# EAGLE schematic LED_matrix (EAGLE 7.7.0)
DRAWING_NUMBER: S001; DRAWN: Mario Blunk / Blunk electronic; PROJECT: LED-Matrix; STATUS: EDUCATION

## Sheet 1 of 11
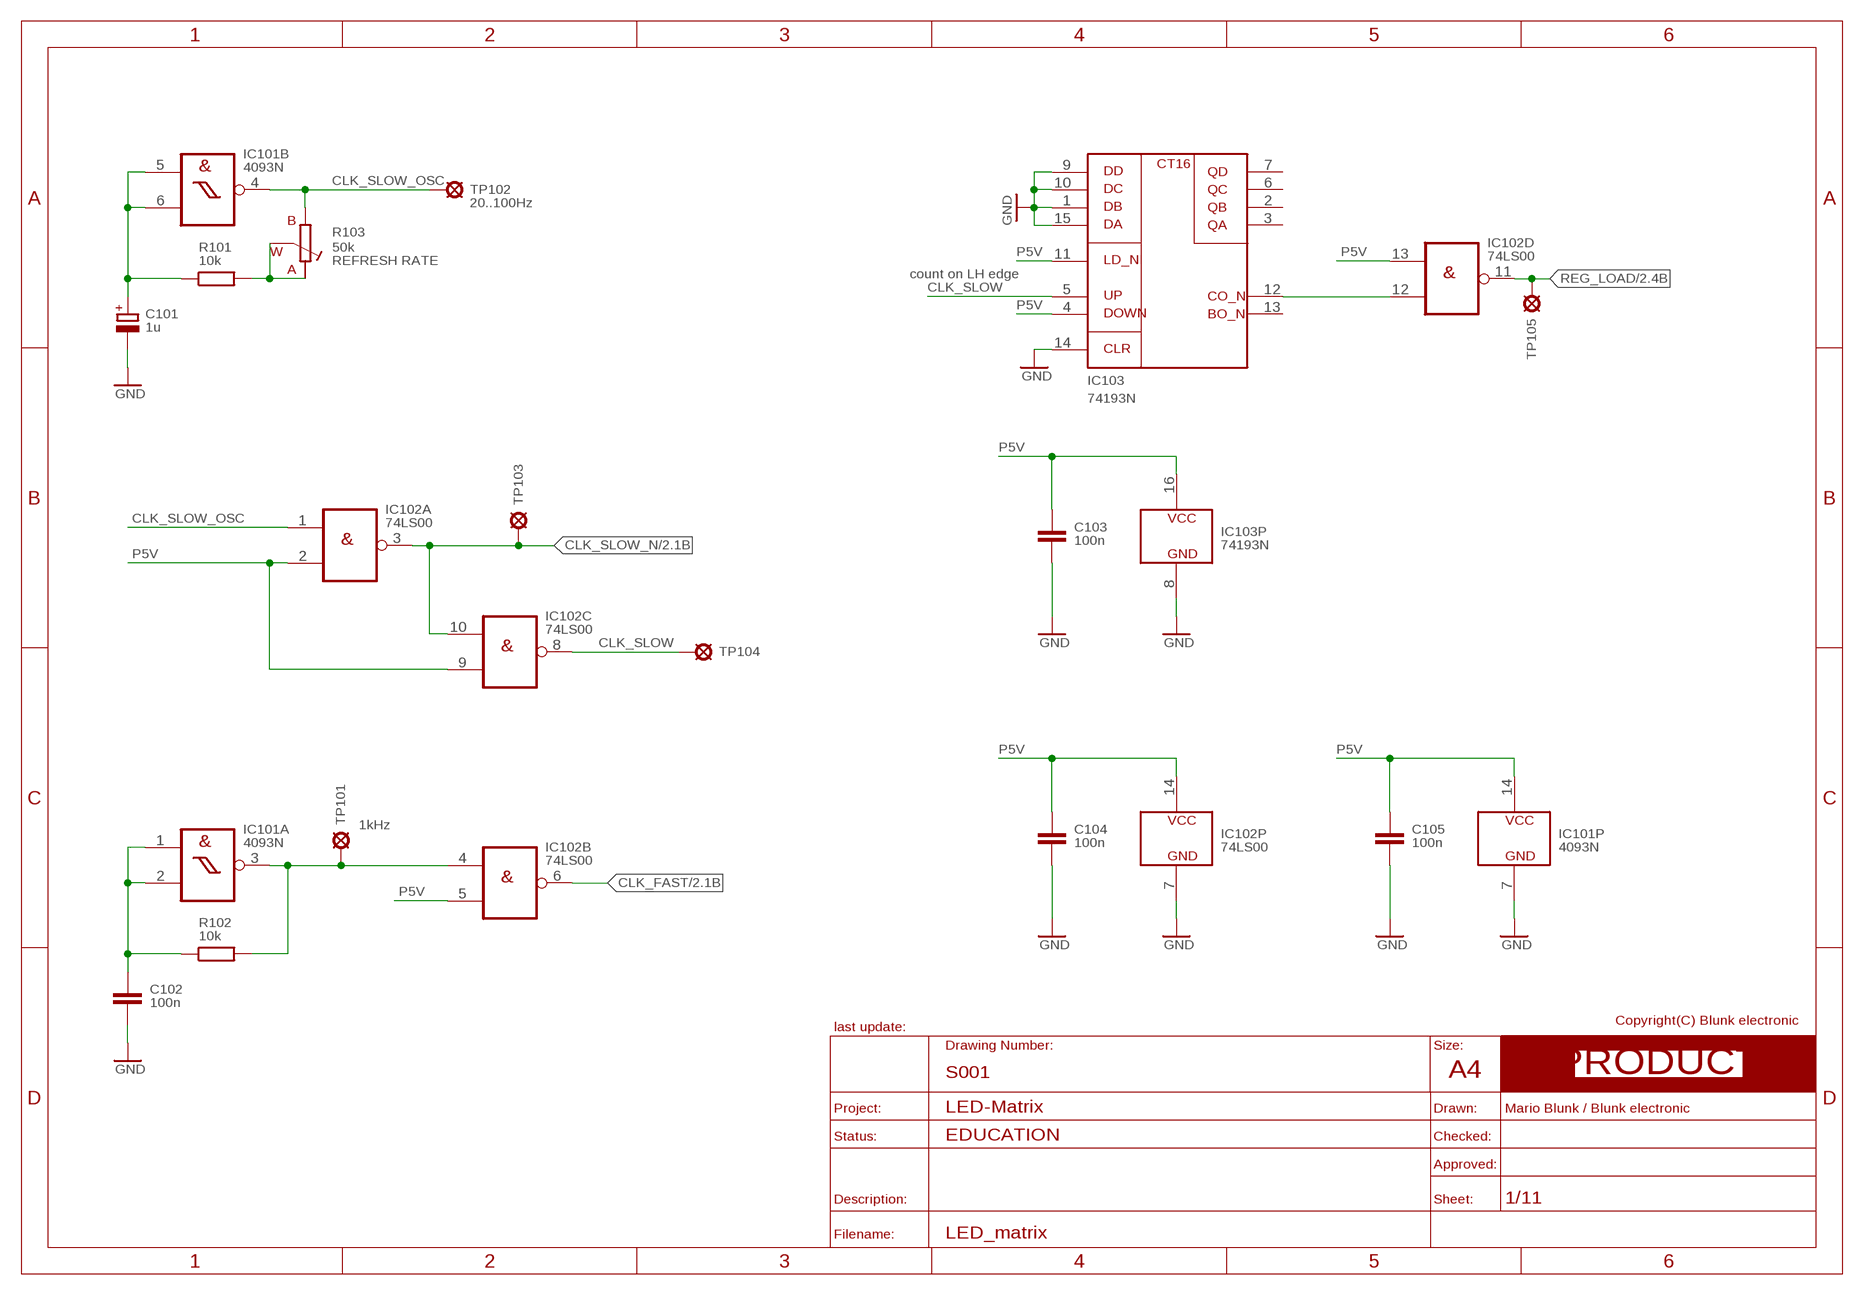
[diagram p0: schematic, sheet 1]
FRAME_PRODUCT1 (A4_LANDSCAPE_PRODUCT): BOM: NO; COMMISSIONED: 2013-08-30

### Parts
C101  1u  C_POL_T_RAD5_GRID_2.54  [T_RADIAL_5MM_GRID_2.54MM]
C102  100n  C_T_DISC_4MM_PITCH_5MM  [T_DISC_4MM_PITCH_5MM]
C103  100n  C_T_DISC_4MM_PITCH_5MM  [T_DISC_4MM_PITCH_5MM]
C104  100n  C_T_DISC_4MM_PITCH_5MM  [T_DISC_4MM_PITCH_5MM]
C105  100n  C_T_DISC_4MM_PITCH_5MM  [T_DISC_4MM_PITCH_5MM]
IC101  4093N  [T_NDIP14]
IC102  74LS00  7400N  [T_NDIP14]
IC103  74193N  [T_NDIP16]
R101  10k  R_T_0207_PITCH_10MM  [T_0207_PITCH_10MM]
R102  10k  R_T_0207_PITCH_10MM  [T_0207_PITCH_10MM]
R103  50k  RA_T_PT10_HORIZONTAL  [T_TRIM_PIHER_PT10_HORIZONTAL]
TP101  TEST_POINT_T_SMALL  [T_TEST_POINT_SMALL]
TP102  TEST_POINT_T_SMALL  [T_TEST_POINT_SMALL]
TP103  TEST_POINT_T_SMALL  [T_TEST_POINT_SMALL]
TP104  TEST_POINT_T_SMALL  [T_TEST_POINT_SMALL]
TP105  TEST_POINT_T_SMALL  [T_TEST_POINT_SMALL]

### Nets
CLK_FAST: IC102.6(B:O) ; also sheet 2
CLK_FAST_OSC: IC101.3(A:O) IC102.4(B:I0) R102.2 TP101.1(TP)
CLK_FAST_RC: C102.1 IC101.1(A:I0) IC101.2(A:I1) R102.1
CLK_SLOW: IC102.8(C:O) IC103.5(UP) TP104.1(TP)
CLK_SLOW_N: IC102.3(A:O) IC102.10(C:I0) TP103.1(TP) ; also sheet 2,3,4,5
CLK_SLOW_OSC: IC101.4(B:O) IC102.1(A:I0) R103.B TP102.1(TP)
CLK_SLOW_RA: R101.2 R103.A R103.W
CLK_SLOW_RC: C101.+ IC101.5(B:I0) IC101.6(B:I1) R101.1
CT_CO_N: IC102.12(D:I1) IC103.12(CO_N)
GND: C101.- C102.2 C103.2 C104.2 C105.2 IC101.7(P:GND) IC102.7(P:GND) IC103.1(DB) IC103.8(GND) IC103.9(DD) IC103.10(DC) IC103.14(CLR) IC103.15(DA) ; also sheet 2,3,4,5,7,8,9,10,11
P5V: C103.1 C104.1 C105.1 IC101.14(P:VCC) IC102.2(A:I1) IC102.5(B:I1) IC102.9(C:I1) IC102.13(D:I0) IC102.14(P:VCC) IC103.4(DOWN) IC103.11(LD_N) IC103.16(VCC) ; also sheet 2,3,4,5,6,9,10,11
REG_LOAD: IC102.11(D:O) TP105.1(TP) ; also sheet 2,3,4,5
Unconnected: IC103.2(QB) IC103.3(QA) IC103.6(QC) IC103.7(QD) IC103.13(BO_N)

### Notes on the sheet
- 20..100Hz
- count on LH edge
- 1kHz

## Sheet 2 of 11
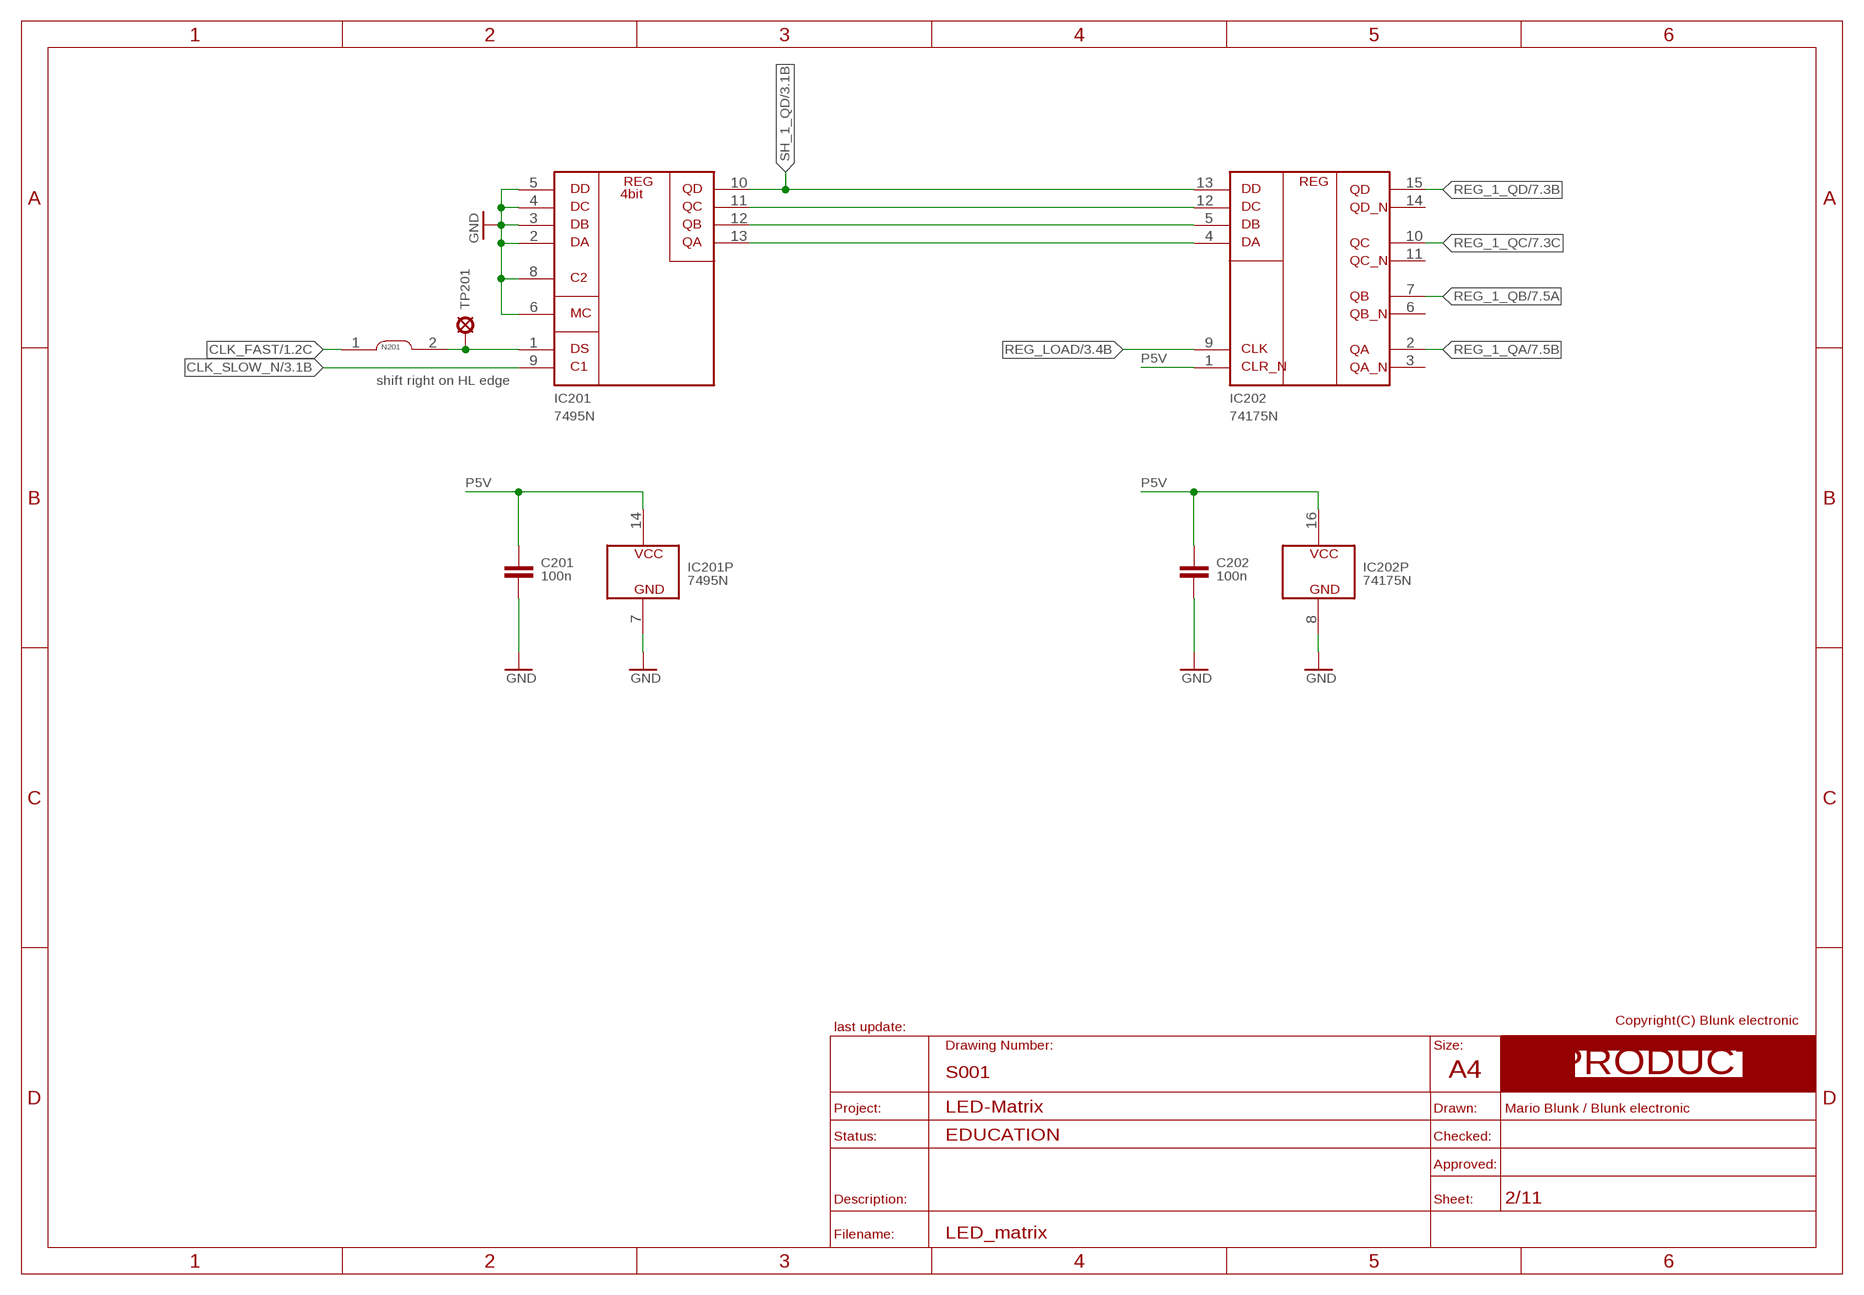
[diagram p1: schematic, sheet 2]
FRAME_PRODUCT2 (A4_LANDSCAPE_PRODUCT): BOM: NO; COMMISSIONED: 2013-08-30

### Parts
C201  100n  C_T_DISC_4MM_PITCH_5MM  [T_DISC_4MM_PITCH_5MM]
C202  100n  C_T_DISC_4MM_PITCH_5MM  [T_DISC_4MM_PITCH_5MM]
IC201  7495N  [T_NDIP14]
IC202  74175N  [T_NDIP16]
N201  NET_CHANGER-S-0.3MM  [S_NET_CHANGER_0.3MM]
TP201  TEST_POINT_T_SMALL  [T_TEST_POINT_SMALL]

### Nets
CLK_FAST: N201.1 ; also sheet 1
CLK_SLOW_N: IC201.9(C1) ; also sheet 1,3,4,5
GND: C201.2 C202.2 IC201.2(DA) IC201.3(DB) IC201.4(DC) IC201.5(DD) IC201.6(MC) IC201.7(GND) IC201.8(C2) IC202.8(GND) ; also sheet 1,3,4,5,7,8,9,10,11
P5V: C201.1 C202.1 IC201.14(VCC) IC202.1(CLR_N) IC202.16(VCC) ; also sheet 1,3,4,5,6,9,10,11
REG_1_QA: IC202.2(QA) ; also sheet 7
REG_1_QB: IC202.7(QB) ; also sheet 7
REG_1_QC: IC202.10(QC) ; also sheet 7
REG_1_QD: IC202.15(QD) ; also sheet 7
REG_LOAD: IC202.9(CLK) ; also sheet 1,3,4,5
SH_1_DS: IC201.1(DS) N201.2 TP201.1(TP)
SH_1_QA: IC201.13(QA) IC202.4(DA)
SH_1_QB: IC201.12(QB) IC202.5(DB)
SH_1_QC: IC201.11(QC) IC202.12(DC)
SH_1_QD: IC201.10(QD) IC202.13(DD) ; also sheet 3
Unconnected: IC202.3(QA_N) IC202.6(QB_N) IC202.11(QC_N) IC202.14(QD_N)

### Notes on the sheet
- shift right on HL edge

## Sheet 3 of 11
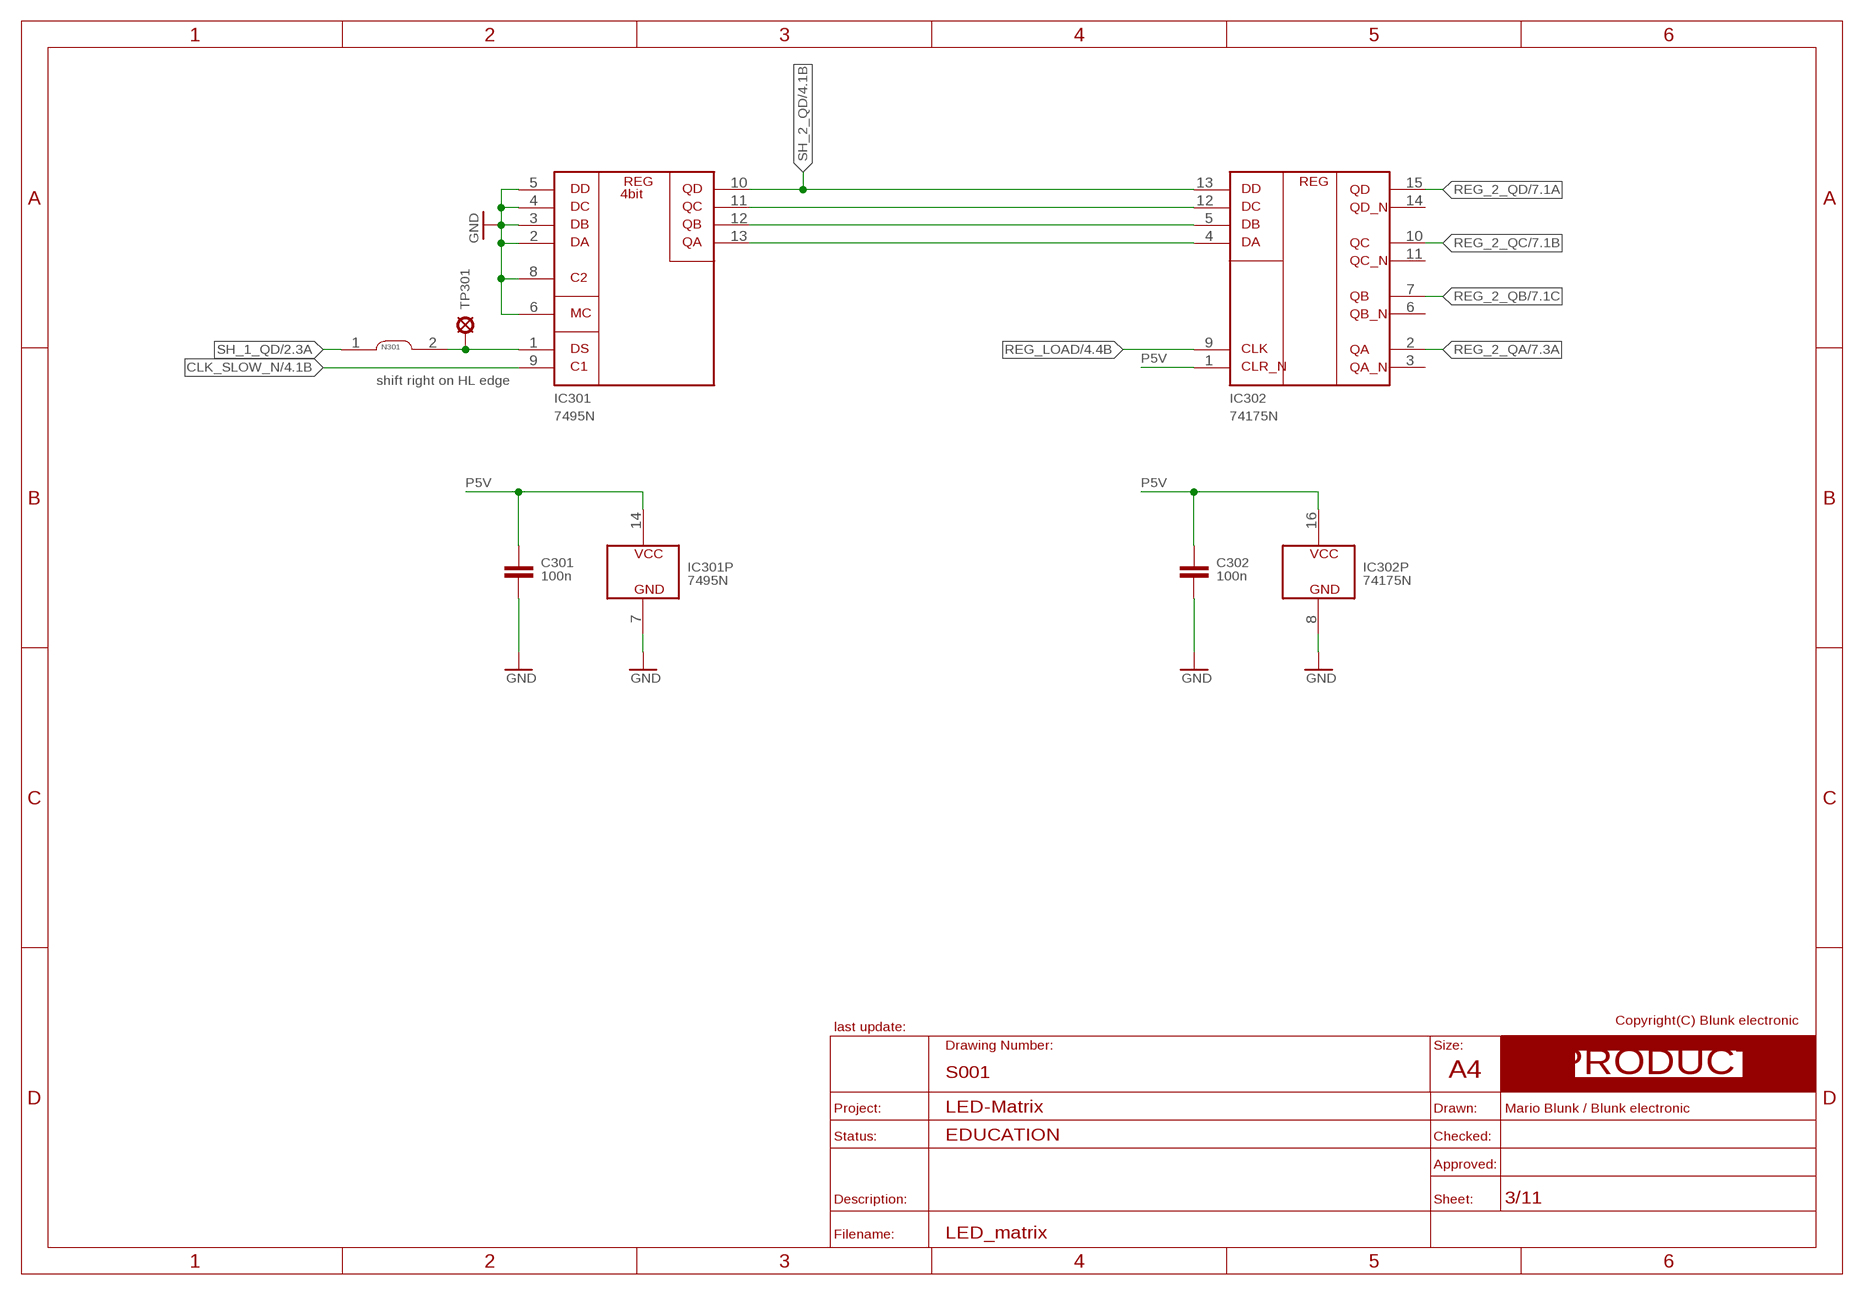
[diagram p2: schematic, sheet 3]
FRAME_PRODUCT6 (A4_LANDSCAPE_PRODUCT): BOM: NO; COMMISSIONED: 2013-08-30

### Parts
C301  100n  C_T_DISC_4MM_PITCH_5MM  [T_DISC_4MM_PITCH_5MM]
C302  100n  C_T_DISC_4MM_PITCH_5MM  [T_DISC_4MM_PITCH_5MM]
IC301  7495N  [T_NDIP14]
IC302  74175N  [T_NDIP16]
N301  NET_CHANGER-S-0.3MM  [S_NET_CHANGER_0.3MM]
TP301  TEST_POINT_T_SMALL  [T_TEST_POINT_SMALL]

### Nets
CLK_SLOW_N: IC301.9(C1) ; also sheet 1,2,4,5
GND: C301.2 C302.2 IC301.2(DA) IC301.3(DB) IC301.4(DC) IC301.5(DD) IC301.6(MC) IC301.7(GND) IC301.8(C2) IC302.8(GND) ; also sheet 1,2,4,5,7,8,9,10,11
P5V: C301.1 C302.1 IC301.14(VCC) IC302.1(CLR_N) IC302.16(VCC) ; also sheet 1,2,4,5,6,9,10,11
REG_2_QA: IC302.2(QA) ; also sheet 7
REG_2_QB: IC302.7(QB) ; also sheet 7
REG_2_QC: IC302.10(QC) ; also sheet 7
REG_2_QD: IC302.15(QD) ; also sheet 7
REG_LOAD: IC302.9(CLK) ; also sheet 1,2,4,5
SH_1_DS1: IC301.1(DS) N301.2 TP301.1(TP)
SH_1_QD: N301.1 ; also sheet 2
SH_2_QA: IC301.13(QA) IC302.4(DA)
SH_2_QB: IC301.12(QB) IC302.5(DB)
SH_2_QC: IC301.11(QC) IC302.12(DC)
SH_2_QD: IC301.10(QD) IC302.13(DD) ; also sheet 4
Unconnected: IC302.3(QA_N) IC302.6(QB_N) IC302.11(QC_N) IC302.14(QD_N)

### Notes on the sheet
- shift right on HL edge

## Sheet 4 of 11
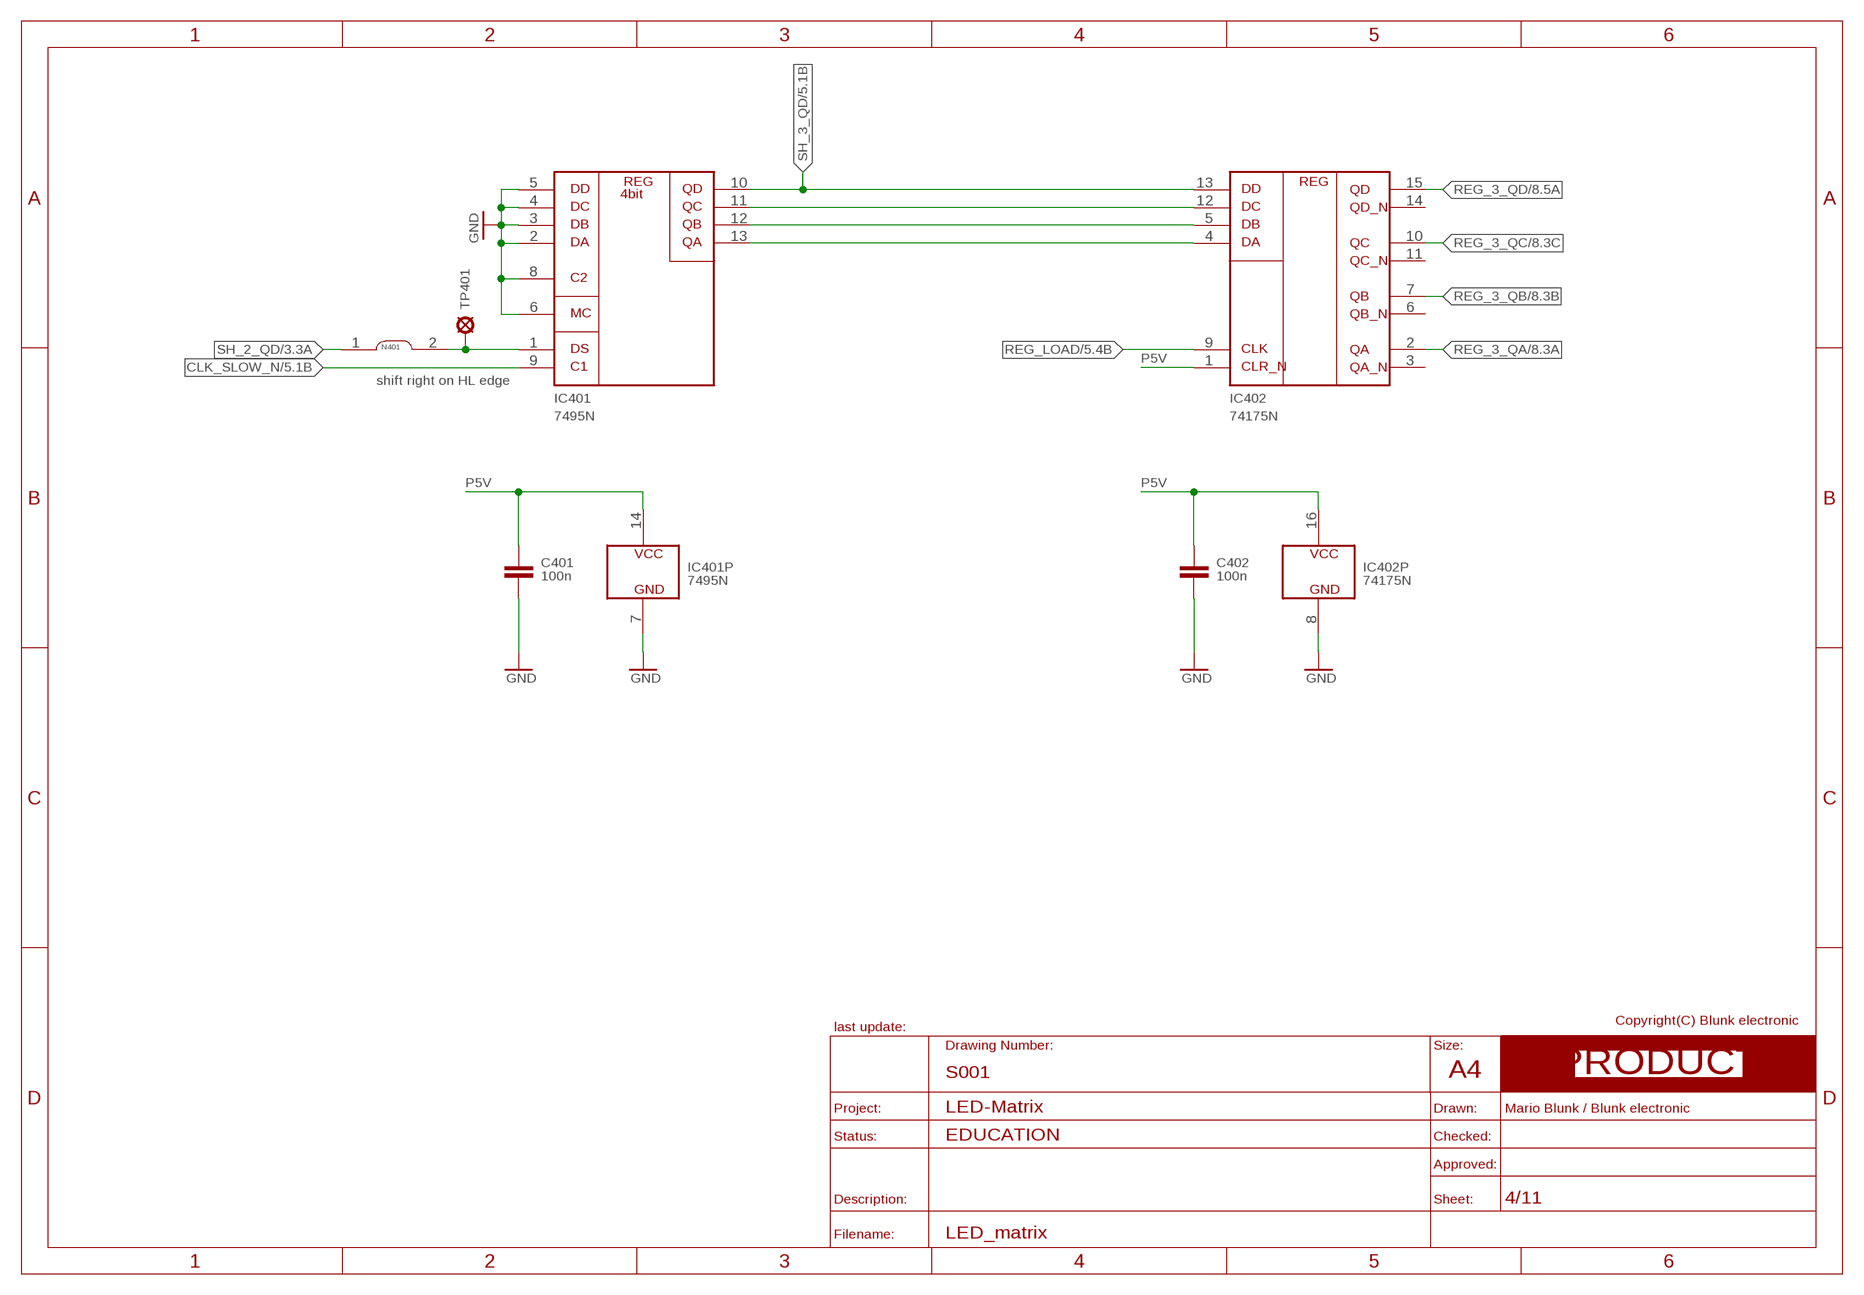
[diagram p3: schematic, sheet 4]
FRAME_PRODUCT7 (A4_LANDSCAPE_PRODUCT): BOM: NO; COMMISSIONED: 2013-08-30

### Parts
C401  100n  C_T_DISC_4MM_PITCH_5MM  [T_DISC_4MM_PITCH_5MM]
C402  100n  C_T_DISC_4MM_PITCH_5MM  [T_DISC_4MM_PITCH_5MM]
IC401  7495N  [T_NDIP14]
IC402  74175N  [T_NDIP16]
N401  NET_CHANGER-S-0.3MM  [S_NET_CHANGER_0.3MM]
TP401  TEST_POINT_T_SMALL  [T_TEST_POINT_SMALL]

### Nets
CLK_SLOW_N: IC401.9(C1) ; also sheet 1,2,3,5
GND: C401.2 C402.2 IC401.2(DA) IC401.3(DB) IC401.4(DC) IC401.5(DD) IC401.6(MC) IC401.7(GND) IC401.8(C2) IC402.8(GND) ; also sheet 1,2,3,5,7,8,9,10,11
P5V: C401.1 C402.1 IC401.14(VCC) IC402.1(CLR_N) IC402.16(VCC) ; also sheet 1,2,3,5,6,9,10,11
REG_3_QA: IC402.2(QA) ; also sheet 8
REG_3_QB: IC402.7(QB) ; also sheet 8
REG_3_QC: IC402.10(QC) ; also sheet 8
REG_3_QD: IC402.15(QD) ; also sheet 8
REG_LOAD: IC402.9(CLK) ; also sheet 1,2,3,5
SH_1_DS2: IC401.1(DS) N401.2 TP401.1(TP)
SH_2_QD: N401.1 ; also sheet 3
SH_3_QA: IC401.13(QA) IC402.4(DA)
SH_3_QB: IC401.12(QB) IC402.5(DB)
SH_3_QC: IC401.11(QC) IC402.12(DC)
SH_3_QD: IC401.10(QD) IC402.13(DD) ; also sheet 5
Unconnected: IC402.3(QA_N) IC402.6(QB_N) IC402.11(QC_N) IC402.14(QD_N)

### Notes on the sheet
- shift right on HL edge

## Sheet 5 of 11
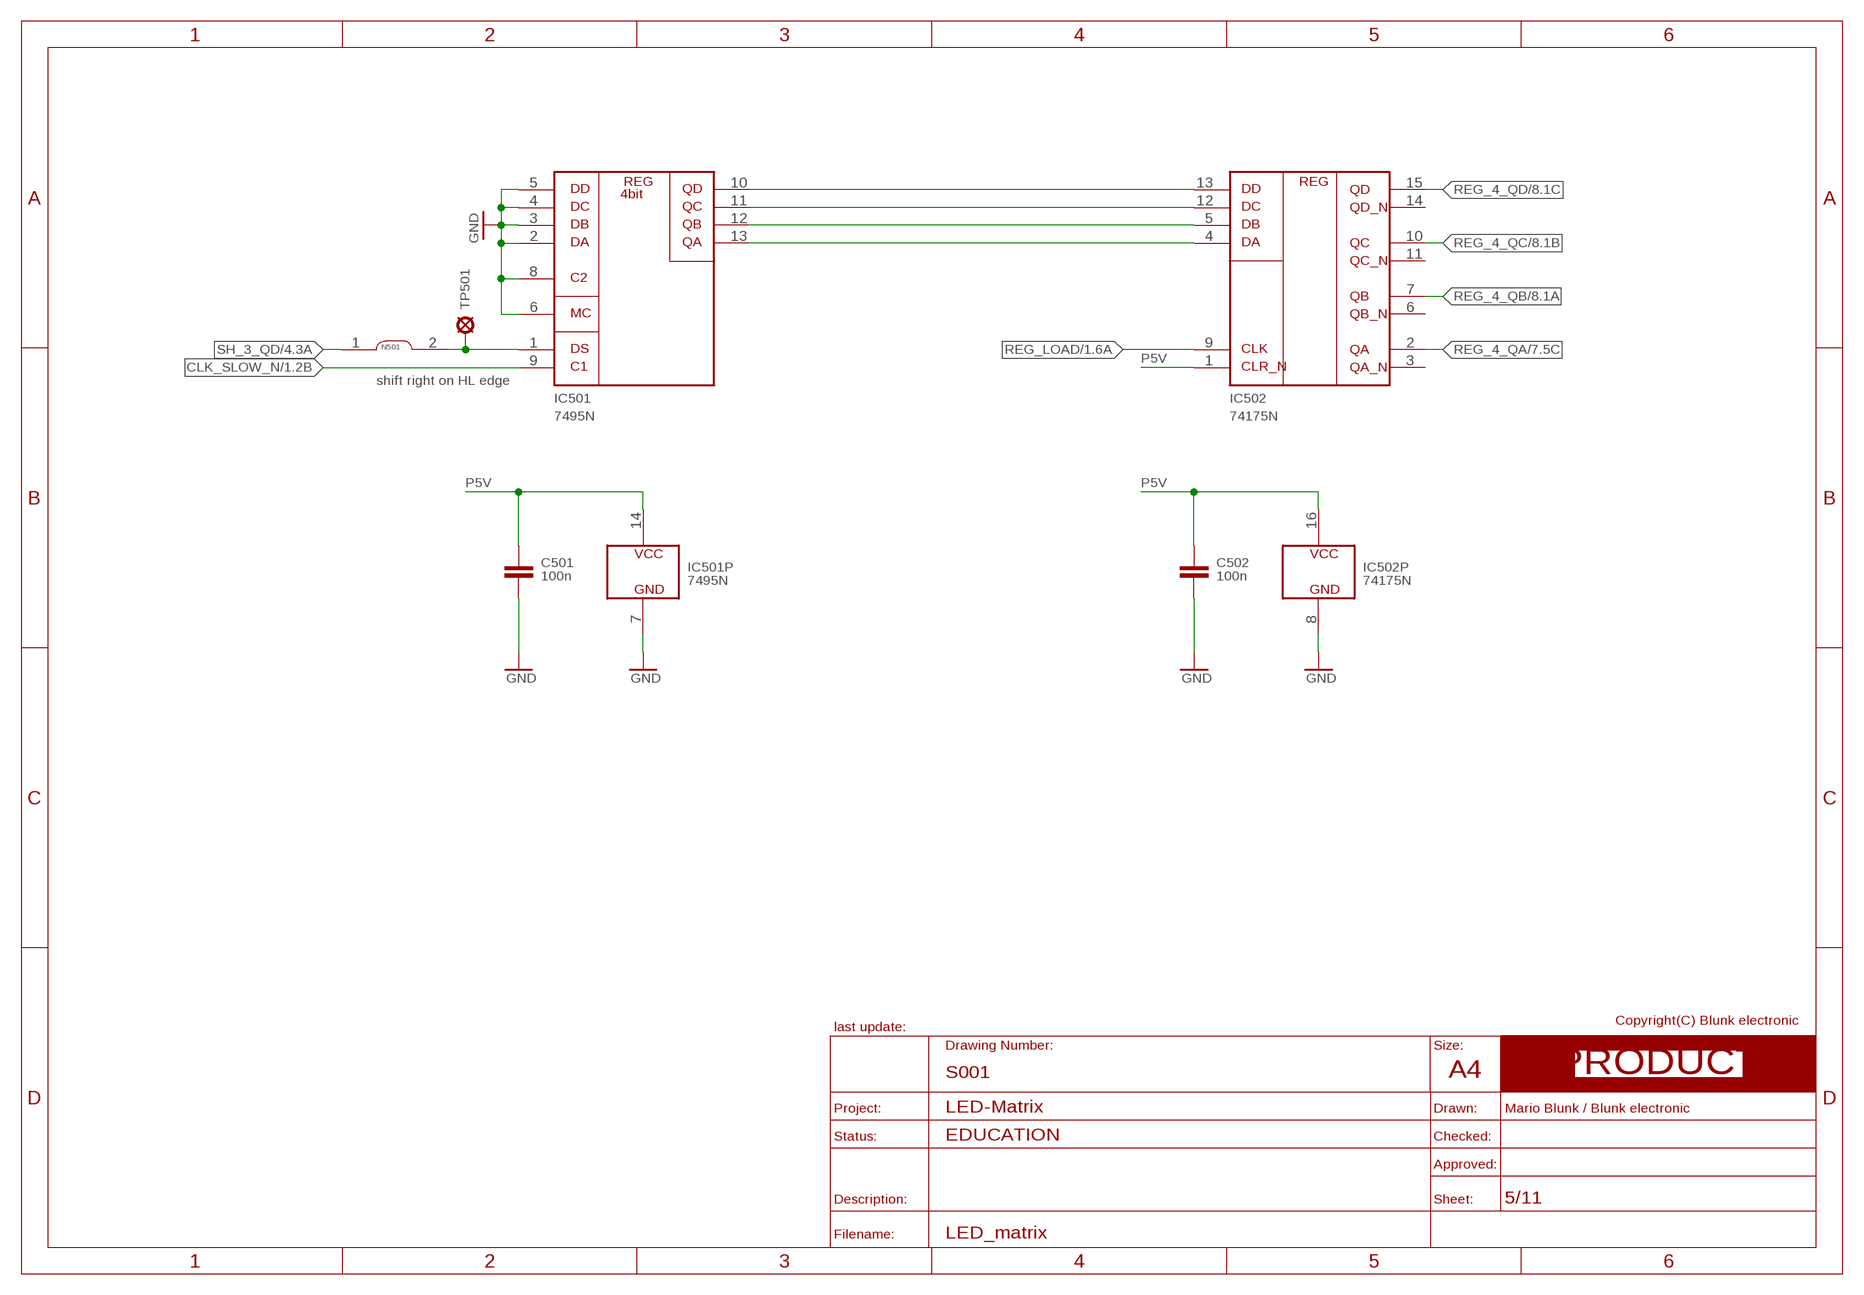
[diagram p4: schematic, sheet 5]
FRAME_PRODUCT8 (A4_LANDSCAPE_PRODUCT): BOM: NO; COMMISSIONED: 2013-08-30

### Parts
C501  100n  C_T_DISC_4MM_PITCH_5MM  [T_DISC_4MM_PITCH_5MM]
C502  100n  C_T_DISC_4MM_PITCH_5MM  [T_DISC_4MM_PITCH_5MM]
IC501  7495N  [T_NDIP14]
IC502  74175N  [T_NDIP16]
N501  NET_CHANGER-S-0.3MM  [S_NET_CHANGER_0.3MM]
TP501  TEST_POINT_T_SMALL  [T_TEST_POINT_SMALL]

### Nets
CLK_SLOW_N: IC501.9(C1) ; also sheet 1,2,3,4
GND: C501.2 C502.2 IC501.2(DA) IC501.3(DB) IC501.4(DC) IC501.5(DD) IC501.6(MC) IC501.7(GND) IC501.8(C2) IC502.8(GND) ; also sheet 1,2,3,4,7,8,9,10,11
P5V: C501.1 C502.1 IC501.14(VCC) IC502.1(CLR_N) IC502.16(VCC) ; also sheet 1,2,3,4,6,9,10,11
REG_4_QA: IC502.2(QA) ; also sheet 7
REG_4_QB: IC502.7(QB) ; also sheet 8
REG_4_QC: IC502.10(QC) ; also sheet 8
REG_4_QD: IC502.15(QD) ; also sheet 8
REG_LOAD: IC502.9(CLK) ; also sheet 1,2,3,4
SH_1_DS3: IC501.1(DS) N501.2 TP501.1(TP)
SH_3_QD: N501.1 ; also sheet 4
SH_4_QA: IC501.13(QA) IC502.4(DA)
SH_4_QB: IC501.12(QB) IC502.5(DB)
SH_4_QC: IC501.11(QC) IC502.12(DC)
SH_4_QD: IC501.10(QD) IC502.13(DD)
Unconnected: IC502.3(QA_N) IC502.6(QB_N) IC502.11(QC_N) IC502.14(QD_N)

### Notes on the sheet
- shift right on HL edge

## Sheet 6 of 11
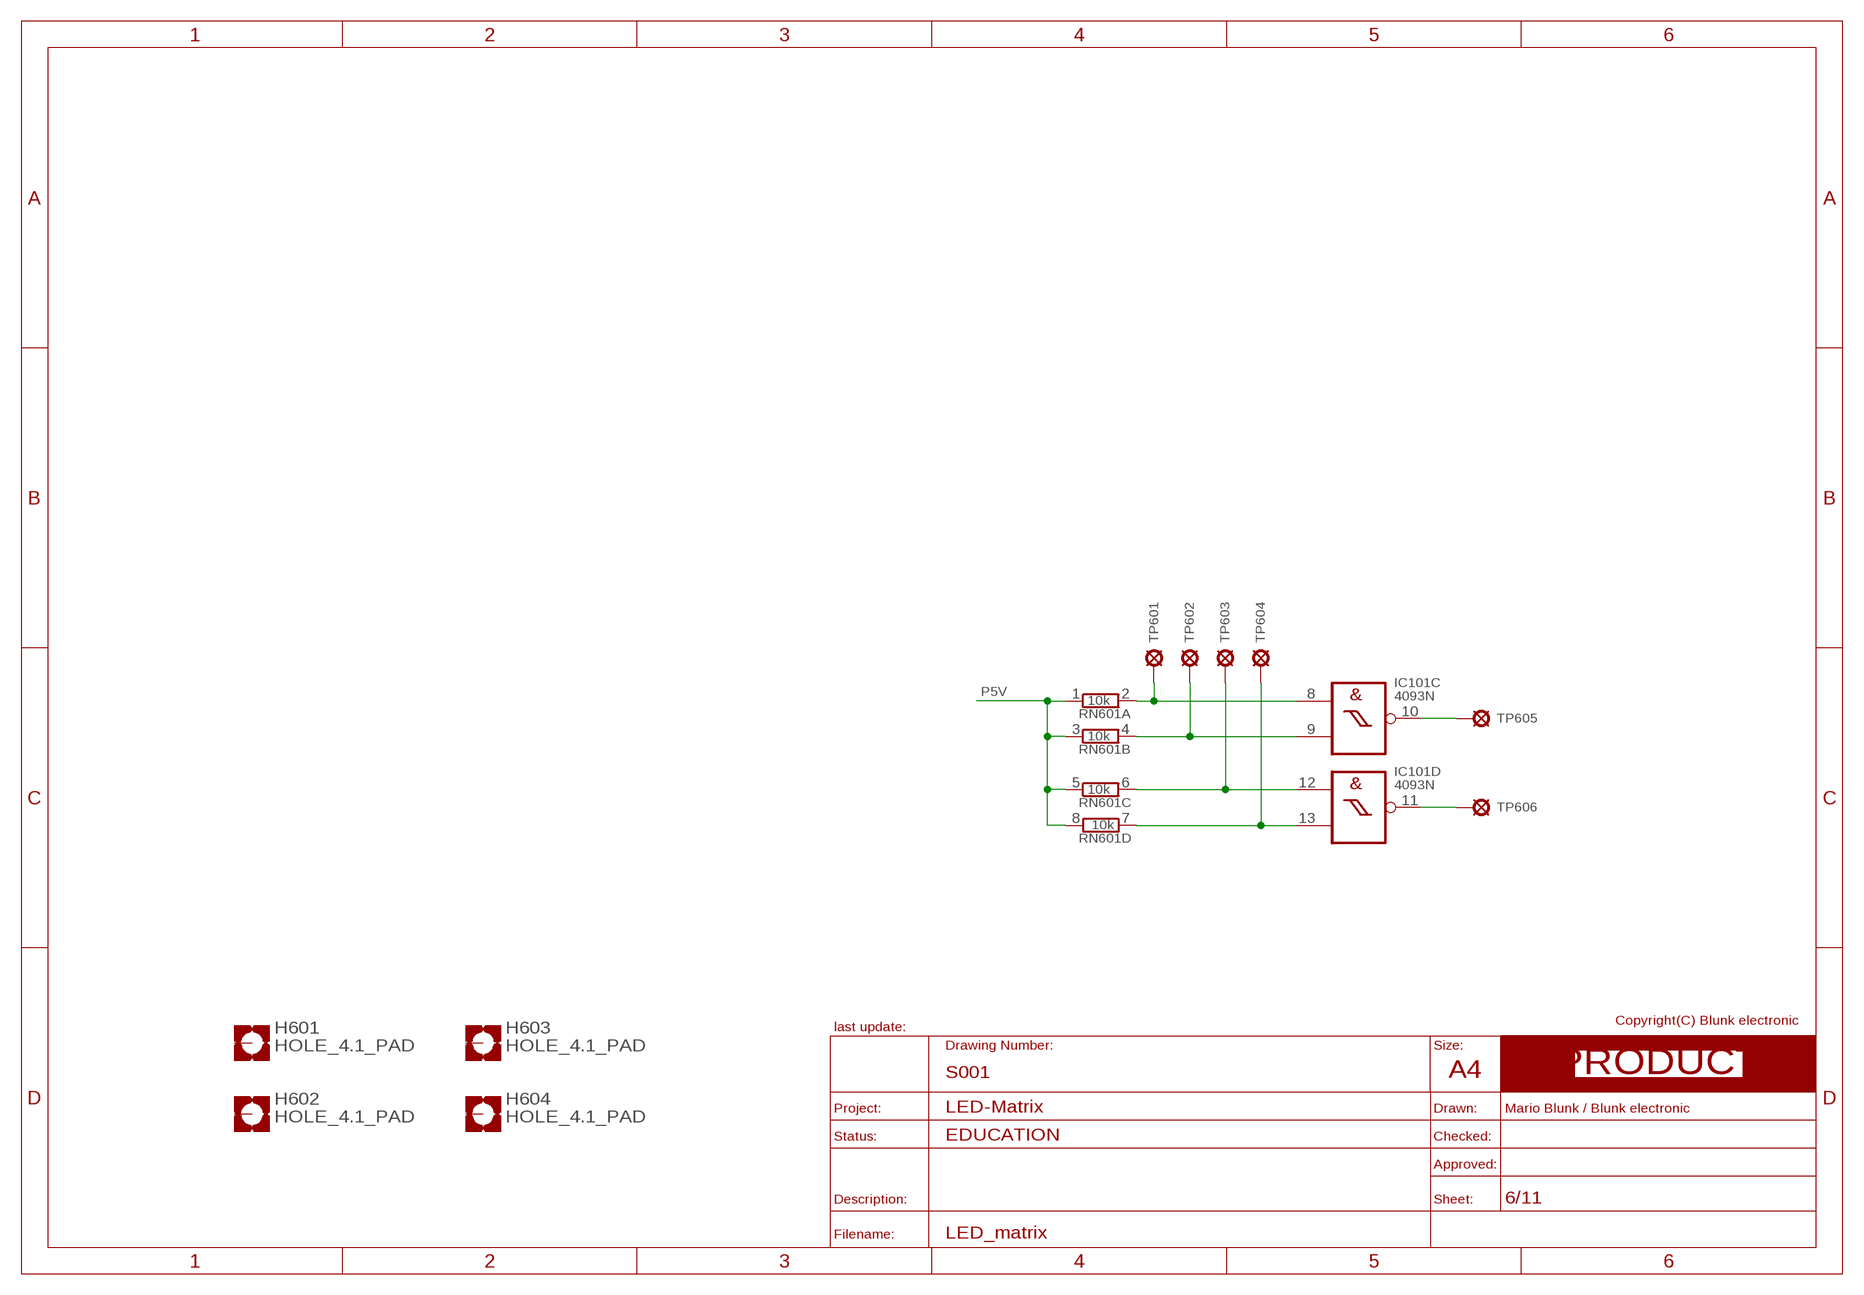
[diagram p5: schematic, sheet 6]
FRAME_PRODUCT3 (A4_LANDSCAPE_PRODUCT): BOM: NO; COMMISSIONED: 2013-08-30

### Parts
H601  HOLE_4.1_PAD  [4.1_PAD]
H602  HOLE_4.1_PAD  [4.1_PAD]
H603  HOLE_4.1_PAD  [4.1_PAD]
H604  HOLE_4.1_PAD  [4.1_PAD]
RN601  10k  RN_4T_SIL8  [T_SIL8]
TP601  TEST_POINT_T_SMALL  [T_TEST_POINT_SMALL]
TP602  TEST_POINT_T_SMALL  [T_TEST_POINT_SMALL]
TP603  TEST_POINT_T_SMALL  [T_TEST_POINT_SMALL]
TP604  TEST_POINT_T_SMALL  [T_TEST_POINT_SMALL]
TP605  TEST_POINT_T_SMALL  [T_TEST_POINT_SMALL]
TP606  TEST_POINT_T_SMALL  [T_TEST_POINT_SMALL]

### Nets
P5V: RN601.1 RN601.3 RN601.5 RN601.8 ; also sheet 1,2,3,4,5,9,10,11
RSV_IN_1: IC101.8(C:I0) RN601.2 TP601.1(TP)
RSV_IN_2: IC101.9(C:I1) RN601.4 TP602.1(TP)
RSV_IN_3: IC101.12(D:I0) RN601.6 TP603.1(TP)
RSV_IN_4: IC101.13(D:I1) RN601.7 TP604.1(TP)
RSV_OUT_1: IC101.10(C:O) TP605.1(TP)
RSV_OUT_2: IC101.11(D:O) TP606.1(TP)
Unconnected: H601.H1(MOUNT) H602.H1(MOUNT) H603.H1(MOUNT) H604.H1(MOUNT)

## Sheet 7 of 11
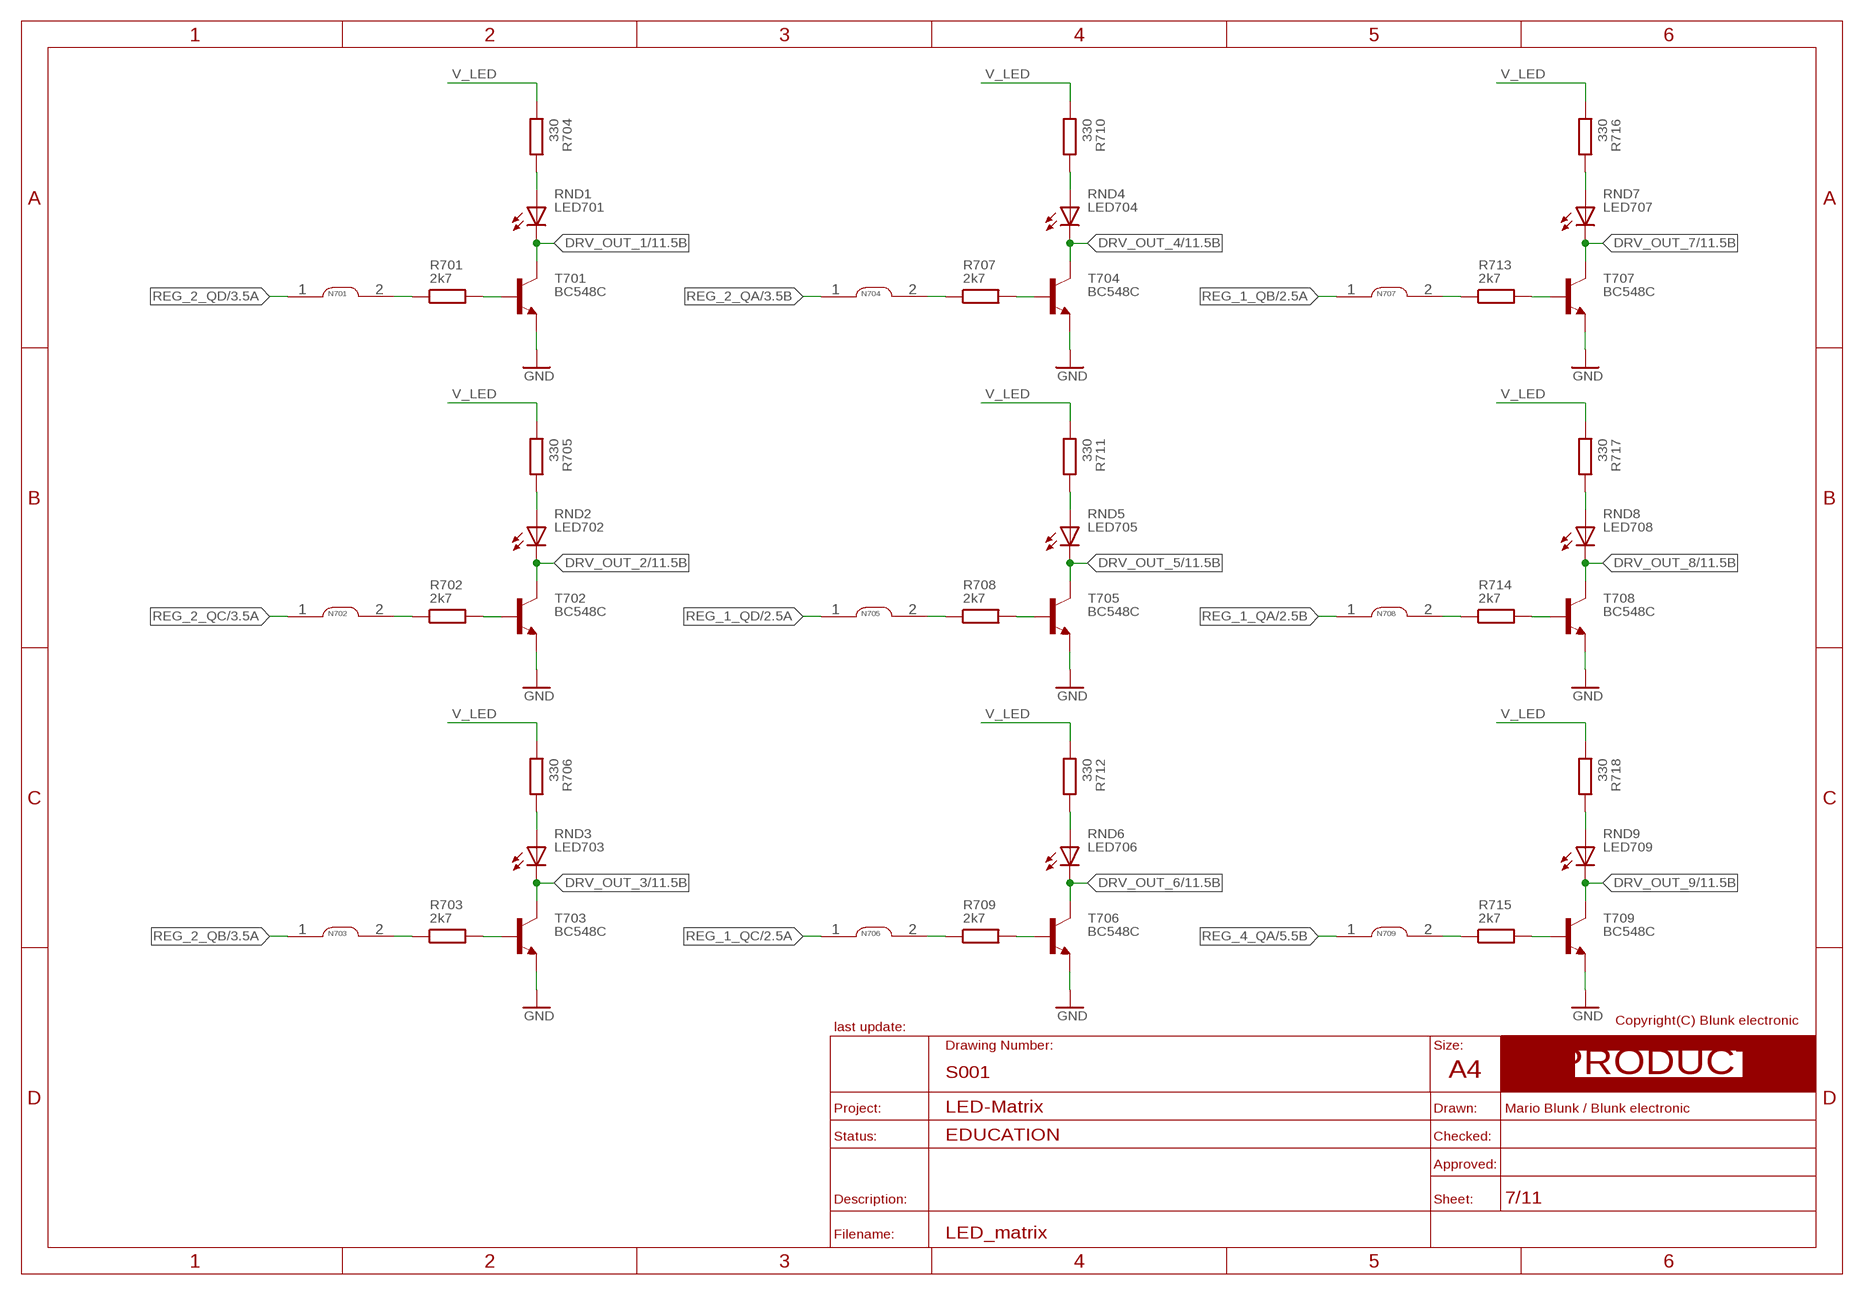
[diagram p6: schematic, sheet 7]
FRAME_PRODUCT4 (A4_LANDSCAPE_PRODUCT): BOM: NO; COMMISSIONED: 2013-08-30

### Parts
LED701  LED_T_ROUND_3MM  [T_ROUND_3MM]
LED702  LED_T_ROUND_3MM  [T_ROUND_3MM]
LED703  LED_T_ROUND_3MM  [T_ROUND_3MM]
LED704  LED_T_ROUND_3MM  [T_ROUND_3MM]
LED705  LED_T_ROUND_3MM  [T_ROUND_3MM]
LED706  LED_T_ROUND_3MM  [T_ROUND_3MM]
LED707  LED_T_ROUND_3MM  [T_ROUND_3MM]
LED708  LED_T_ROUND_3MM  [T_ROUND_3MM]
LED709  LED_T_ROUND_3MM  [T_ROUND_3MM]
N701  NET_CHANGER-S-0.3MM  [S_NET_CHANGER_0.3MM]
N702  NET_CHANGER-S-0.3MM  [S_NET_CHANGER_0.3MM]
N703  NET_CHANGER-S-0.3MM  [S_NET_CHANGER_0.3MM]
N704  NET_CHANGER-S-0.3MM  [S_NET_CHANGER_0.3MM]
N705  NET_CHANGER-S-0.3MM  [S_NET_CHANGER_0.3MM]
N706  NET_CHANGER-S-0.3MM  [S_NET_CHANGER_0.3MM]
N707  NET_CHANGER-S-0.3MM  [S_NET_CHANGER_0.3MM]
N708  NET_CHANGER-S-0.3MM  [S_NET_CHANGER_0.3MM]
N709  NET_CHANGER-S-0.3MM  [S_NET_CHANGER_0.3MM]
R701  2k7  R_T_0207_PITCH_10MM  [T_0207_PITCH_10MM]
R702  2k7  R_T_0207_PITCH_10MM  [T_0207_PITCH_10MM]
R703  2k7  R_T_0207_PITCH_10MM  [T_0207_PITCH_10MM]
R704  330  R_T_0207_PITCH_10MM  [T_0207_PITCH_10MM]
R705  330  R_T_0207_PITCH_10MM  [T_0207_PITCH_10MM]
R706  330  R_T_0207_PITCH_10MM  [T_0207_PITCH_10MM]
R707  2k7  R_T_0207_PITCH_10MM  [T_0207_PITCH_10MM]
R708  2k7  R_T_0207_PITCH_10MM  [T_0207_PITCH_10MM]
R709  2k7  R_T_0207_PITCH_10MM  [T_0207_PITCH_10MM]
R710  330  R_T_0207_PITCH_10MM  [T_0207_PITCH_10MM]
R711  330  R_T_0207_PITCH_10MM  [T_0207_PITCH_10MM]
R712  330  R_T_0207_PITCH_10MM  [T_0207_PITCH_10MM]
R713  2k7  R_T_0207_PITCH_10MM  [T_0207_PITCH_10MM]
R714  2k7  R_T_0207_PITCH_10MM  [T_0207_PITCH_10MM]
R715  2k7  R_T_0207_PITCH_10MM  [T_0207_PITCH_10MM]
R716  330  R_T_0207_PITCH_10MM  [T_0207_PITCH_10MM]
R717  330  R_T_0207_PITCH_10MM  [T_0207_PITCH_10MM]
R718  330  R_T_0207_PITCH_10MM  [T_0207_PITCH_10MM]
T701  BC548C  NPN_T_TO92-CBE  [T_TO92-CBE]
T702  BC548C  NPN_T_TO92-CBE  [T_TO92-CBE]
T703  BC548C  NPN_T_TO92-CBE  [T_TO92-CBE]
T704  BC548C  NPN_T_TO92-CBE  [T_TO92-CBE]
T705  BC548C  NPN_T_TO92-CBE  [T_TO92-CBE]
T706  BC548C  NPN_T_TO92-CBE  [T_TO92-CBE]
T707  BC548C  NPN_T_TO92-CBE  [T_TO92-CBE]
T708  BC548C  NPN_T_TO92-CBE  [T_TO92-CBE]
T709  BC548C  NPN_T_TO92-CBE  [T_TO92-CBE]

### Nets
DRV_IN_1: N701.2 R701.1
DRV_IN_2: N702.2 R702.1
DRV_IN_3: N703.2 R703.1
DRV_IN_4: N704.2 R707.1
DRV_IN_5: N705.2 R708.1
DRV_IN_6: N706.2 R709.1
DRV_IN_7: N707.2 R713.1
DRV_IN_8: N708.2 R714.1
DRV_IN_9: N709.2 R715.1
DRV_IN_B1: R701.2 T701.B
DRV_IN_B2: R702.2 T702.B
DRV_IN_B3: R703.2 T703.B
DRV_IN_B4: R707.2 T704.B
DRV_IN_B5: R708.2 T705.B
DRV_IN_B6: R709.2 T706.B
DRV_IN_B7: R713.2 T707.B
DRV_IN_B8: R714.2 T708.B
DRV_IN_B9: R715.2 T709.B
DRV_OUT_1: LED701.C T701.C ; also sheet 11
DRV_OUT_2: LED702.C T702.C ; also sheet 11
DRV_OUT_3: LED703.C T703.C ; also sheet 11
DRV_OUT_4: LED704.C T704.C ; also sheet 11
DRV_OUT_5: LED705.C T705.C ; also sheet 11
DRV_OUT_6: LED706.C T706.C ; also sheet 11
DRV_OUT_7: LED707.C T707.C ; also sheet 11
DRV_OUT_8: LED708.C T708.C ; also sheet 11
DRV_OUT_9: LED709.C T709.C ; also sheet 11
DRV_OUT_A_1: LED701.A R704.2
DRV_OUT_A_2: LED702.A R705.2
DRV_OUT_A_3: LED703.A R706.2
DRV_OUT_A_4: LED704.A R710.2
DRV_OUT_A_5: LED705.A R711.2
DRV_OUT_A_6: LED706.A R712.2
DRV_OUT_A_7: LED707.A R716.2
DRV_OUT_A_8: LED708.A R717.2
DRV_OUT_A_9: LED709.A R718.2
GND: T701.E T702.E T703.E T704.E T705.E T706.E T707.E T708.E T709.E ; also sheet 1,2,3,4,5,8,9,10,11
REG_1_QA: N708.1 ; also sheet 2
REG_1_QB: N707.1 ; also sheet 2
REG_1_QC: N706.1 ; also sheet 2
REG_1_QD: N705.1 ; also sheet 2
REG_2_QA: N704.1 ; also sheet 3
REG_2_QB: N703.1 ; also sheet 3
REG_2_QC: N702.1 ; also sheet 3
REG_2_QD: N701.1 ; also sheet 3
REG_4_QA: N709.1 ; also sheet 5
V_LED: R704.1 R705.1 R706.1 R710.1 R711.1 R712.1 R716.1 R717.1 R718.1 ; also sheet 8,9

## Sheet 8 of 11
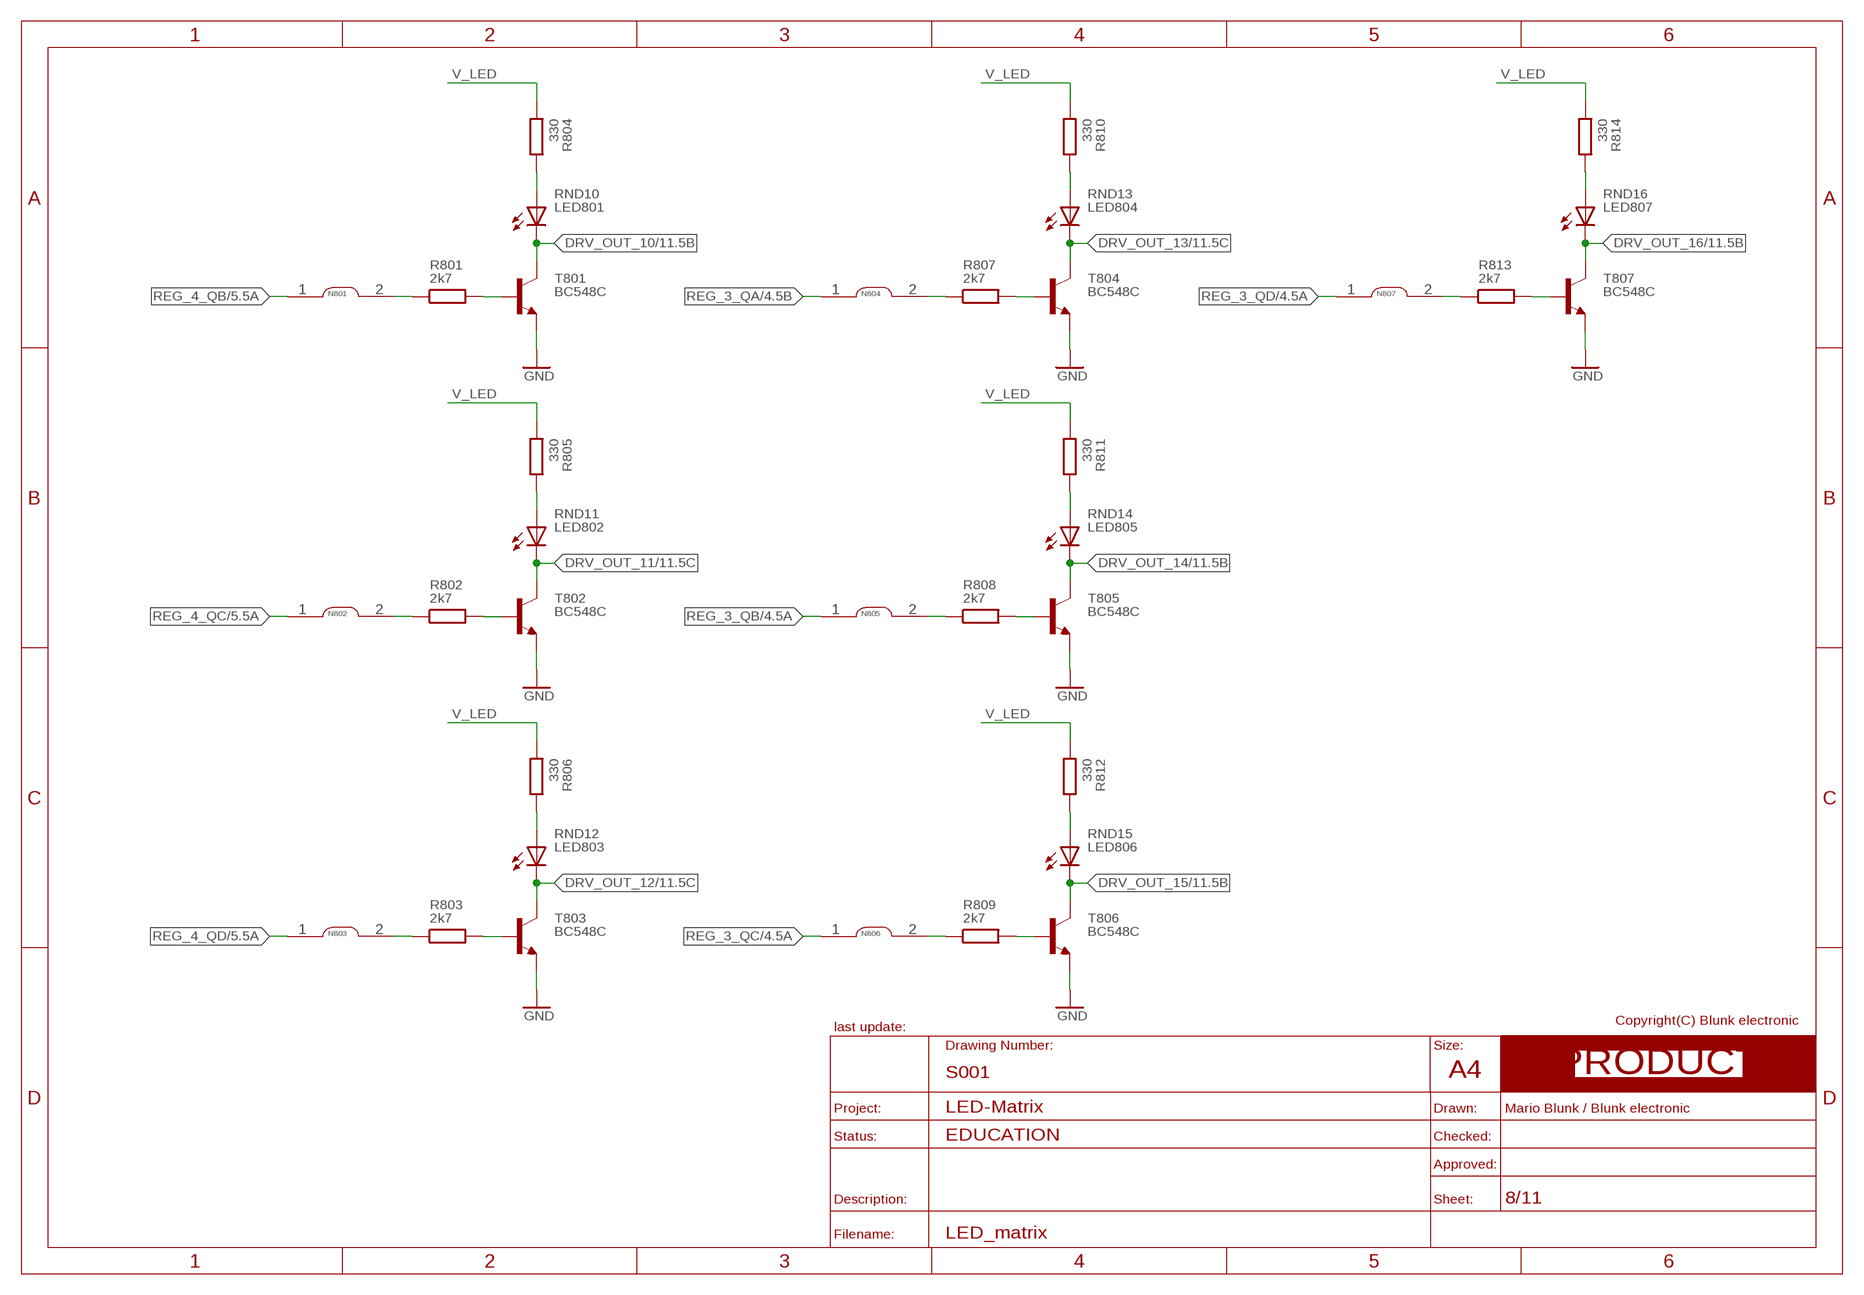
[diagram p7: schematic, sheet 8]
FRAME_PRODUCT5 (A4_LANDSCAPE_PRODUCT): BOM: NO; COMMISSIONED: 2013-08-30

### Parts
LED801  LED_T_ROUND_3MM  [T_ROUND_3MM]
LED802  LED_T_ROUND_3MM  [T_ROUND_3MM]
LED803  LED_T_ROUND_3MM  [T_ROUND_3MM]
LED804  LED_T_ROUND_3MM  [T_ROUND_3MM]
LED805  LED_T_ROUND_3MM  [T_ROUND_3MM]
LED806  LED_T_ROUND_3MM  [T_ROUND_3MM]
LED807  LED_T_ROUND_3MM  [T_ROUND_3MM]
N801  NET_CHANGER-S-0.3MM  [S_NET_CHANGER_0.3MM]
N802  NET_CHANGER-S-0.3MM  [S_NET_CHANGER_0.3MM]
N803  NET_CHANGER-S-0.3MM  [S_NET_CHANGER_0.3MM]
N804  NET_CHANGER-S-0.3MM  [S_NET_CHANGER_0.3MM]
N805  NET_CHANGER-S-0.3MM  [S_NET_CHANGER_0.3MM]
N806  NET_CHANGER-S-0.3MM  [S_NET_CHANGER_0.3MM]
N807  NET_CHANGER-S-0.3MM  [S_NET_CHANGER_0.3MM]
R801  2k7  R_T_0207_PITCH_10MM  [T_0207_PITCH_10MM]
R802  2k7  R_T_0207_PITCH_10MM  [T_0207_PITCH_10MM]
R803  2k7  R_T_0207_PITCH_10MM  [T_0207_PITCH_10MM]
R804  330  R_T_0207_PITCH_10MM  [T_0207_PITCH_10MM]
R805  330  R_T_0207_PITCH_10MM  [T_0207_PITCH_10MM]
R806  330  R_T_0207_PITCH_10MM  [T_0207_PITCH_10MM]
R807  2k7  R_T_0207_PITCH_10MM  [T_0207_PITCH_10MM]
R808  2k7  R_T_0207_PITCH_10MM  [T_0207_PITCH_10MM]
R809  2k7  R_T_0207_PITCH_10MM  [T_0207_PITCH_10MM]
R810  330  R_T_0207_PITCH_10MM  [T_0207_PITCH_10MM]
R811  330  R_T_0207_PITCH_10MM  [T_0207_PITCH_10MM]
R812  330  R_T_0207_PITCH_10MM  [T_0207_PITCH_10MM]
R813  2k7  R_T_0207_PITCH_10MM  [T_0207_PITCH_10MM]
R814  330  R_T_0207_PITCH_10MM  [T_0207_PITCH_10MM]
T801  BC548C  NPN_T_TO92-CBE  [T_TO92-CBE]
T802  BC548C  NPN_T_TO92-CBE  [T_TO92-CBE]
T803  BC548C  NPN_T_TO92-CBE  [T_TO92-CBE]
T804  BC548C  NPN_T_TO92-CBE  [T_TO92-CBE]
T805  BC548C  NPN_T_TO92-CBE  [T_TO92-CBE]
T806  BC548C  NPN_T_TO92-CBE  [T_TO92-CBE]
T807  BC548C  NPN_T_TO92-CBE  [T_TO92-CBE]

### Nets
DRV_IN_10: N801.2 R801.1
DRV_IN_11: N802.2 R802.1
DRV_IN_12: N803.2 R803.1
DRV_IN_13: N804.2 R807.1
DRV_IN_14: N805.2 R808.1
DRV_IN_15: N806.2 R809.1
DRV_IN_16: N807.2 R813.1
DRV_IN_B10: R801.2 T801.B
DRV_IN_B11: R802.2 T802.B
DRV_IN_B12: R803.2 T803.B
DRV_IN_B13: R807.2 T804.B
DRV_IN_B14: R808.2 T805.B
DRV_IN_B15: R809.2 T806.B
DRV_IN_B16: R813.2 T807.B
DRV_OUT_10: LED801.C T801.C ; also sheet 11
DRV_OUT_11: LED802.C T802.C ; also sheet 11
DRV_OUT_12: LED803.C T803.C ; also sheet 11
DRV_OUT_13: LED804.C T804.C ; also sheet 11
DRV_OUT_14: LED805.C T805.C ; also sheet 11
DRV_OUT_15: LED806.C T806.C ; also sheet 11
DRV_OUT_16: LED807.C T807.C ; also sheet 11
DRV_OUT_A_10: LED801.A R804.2
DRV_OUT_A_11: LED802.A R805.2
DRV_OUT_A_12: LED803.A R806.2
DRV_OUT_A_13: LED804.A R810.2
DRV_OUT_A_14: LED805.A R811.2
DRV_OUT_A_15: LED806.A R812.2
DRV_OUT_A_16: LED807.A R814.2
GND: T801.E T802.E T803.E T804.E T805.E T806.E T807.E ; also sheet 1,2,3,4,5,7,9,10,11
REG_3_QA: N804.1 ; also sheet 4
REG_3_QB: N805.1 ; also sheet 4
REG_3_QC: N806.1 ; also sheet 4
REG_3_QD: N807.1 ; also sheet 4
REG_4_QB: N801.1 ; also sheet 5
REG_4_QC: N802.1 ; also sheet 5
REG_4_QD: N803.1 ; also sheet 5
V_LED: R804.1 R805.1 R806.1 R810.1 R811.1 R812.1 R814.1 ; also sheet 7,9

## Sheet 9 of 11
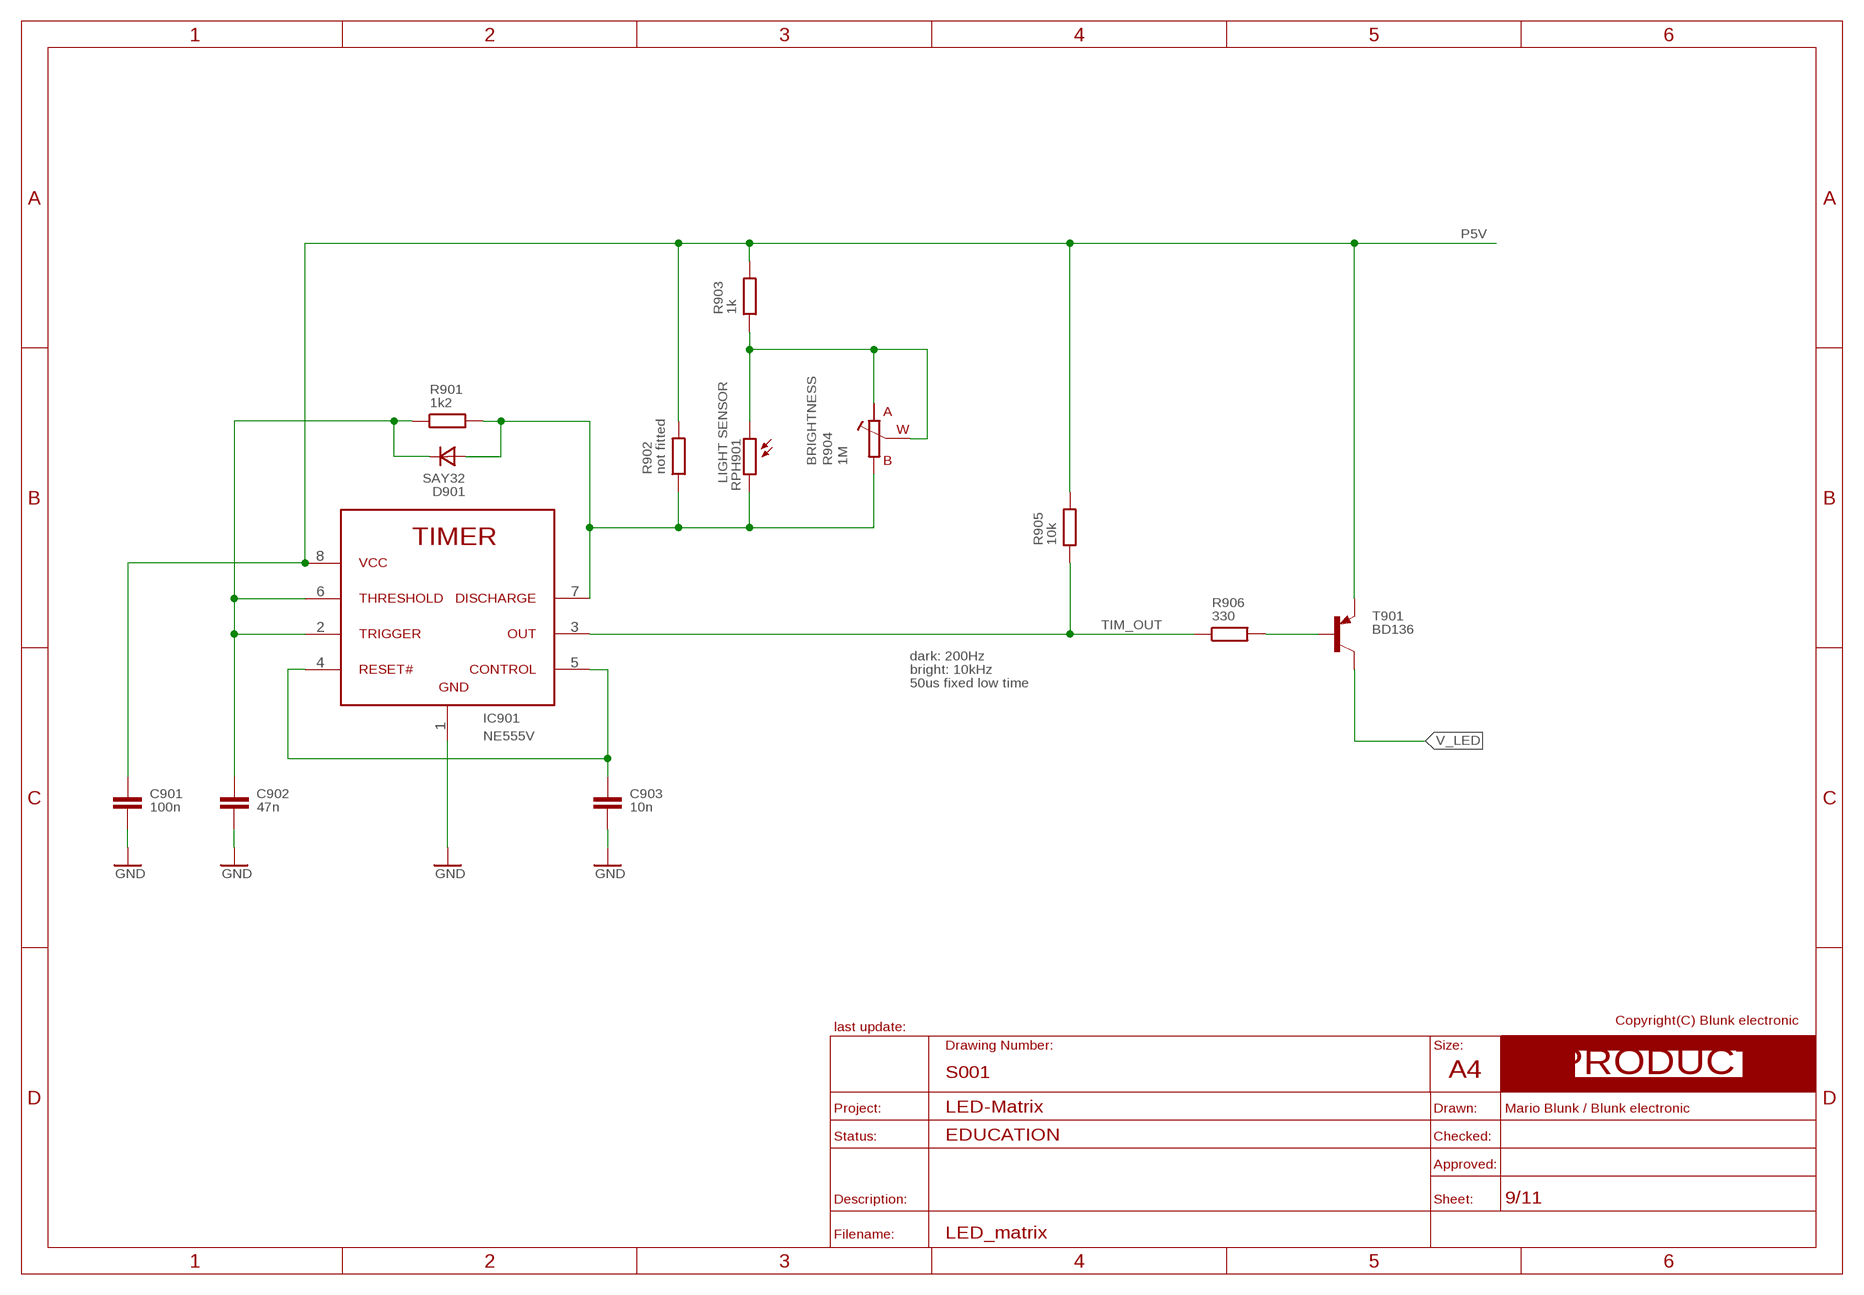
[diagram p8: schematic, sheet 9]
FRAME_PRODUCT9 (A4_LANDSCAPE_PRODUCT): BOM: NO; COMMISSIONED: 2013-08-30

### Parts
C901  100n  C_T_DISC_4MM_PITCH_5MM  [T_DISC_4MM_PITCH_5MM]
C902  47n  C_T_DISC_4MM_PITCH_5MM  [T_DISC_4MM_PITCH_5MM]
C903  10n  C_T_DISC_4MM_PITCH_5MM  [T_DISC_4MM_PITCH_5MM]
D901  SAY32  SINGLE_T_MINIPLAST  [T_MINIPLAST]
IC901  NE555V  555P  [T_NDIP8]
R901  1k2  R_T_0207_PITCH_10MM  [T_0207_PITCH_10MM]
R902  not fitted  R_T_0207_PITCH_10MM  [T_0207_PITCH_10MM]
R903  1k  R_T_0207_PITCH_10MM  [T_0207_PITCH_10MM]
R904  1M  RA_T_PT10_HORIZONTAL  [T_TRIM_PIHER_PT10_HORIZONTAL]
R905  10k  R_T_0207_PITCH_10MM  [T_0207_PITCH_10MM]
R906  330  R_T_0207_PITCH_10MM  [T_0207_PITCH_10MM]
RPH901  RPH  [T_TO39-2]
T901  BD136  PNP_T_TO126_VERTICAL  [T_TO126_VERTICAL]

### Nets
GND: C901.2 C902.2 C903.2 IC901.1(GND) ; also sheet 1,2,3,4,5,7,8,10,11
P5V: C901.1 IC901.8(VCC) R902.2 R903.2 R905.2 T901.E ; also sheet 1,2,3,4,5,6,10,11
TIM_1: C903.1 IC901.4(RST#) IC901.5(OC)
TIM_2: C902.1 D901.C IC901.2(TRG) IC901.6(TRSHLD) R901.1
TIM_3: D901.A IC901.7(DSCHRG) R901.2 R902.1 R904.B RPH901.2
TIM_OUT: IC901.3(OUT) R905.1 R906.1
TIM_OUT_B: R906.2 T901.B
TIM_RA: R903.1 R904.A R904.W RPH901.1
V_LED: T901.C ; also sheet 7,8

### Notes on the sheet
- dark: 200Hz 
  bright: 10kHz
  50us fixed low time

## Sheet 10 of 11
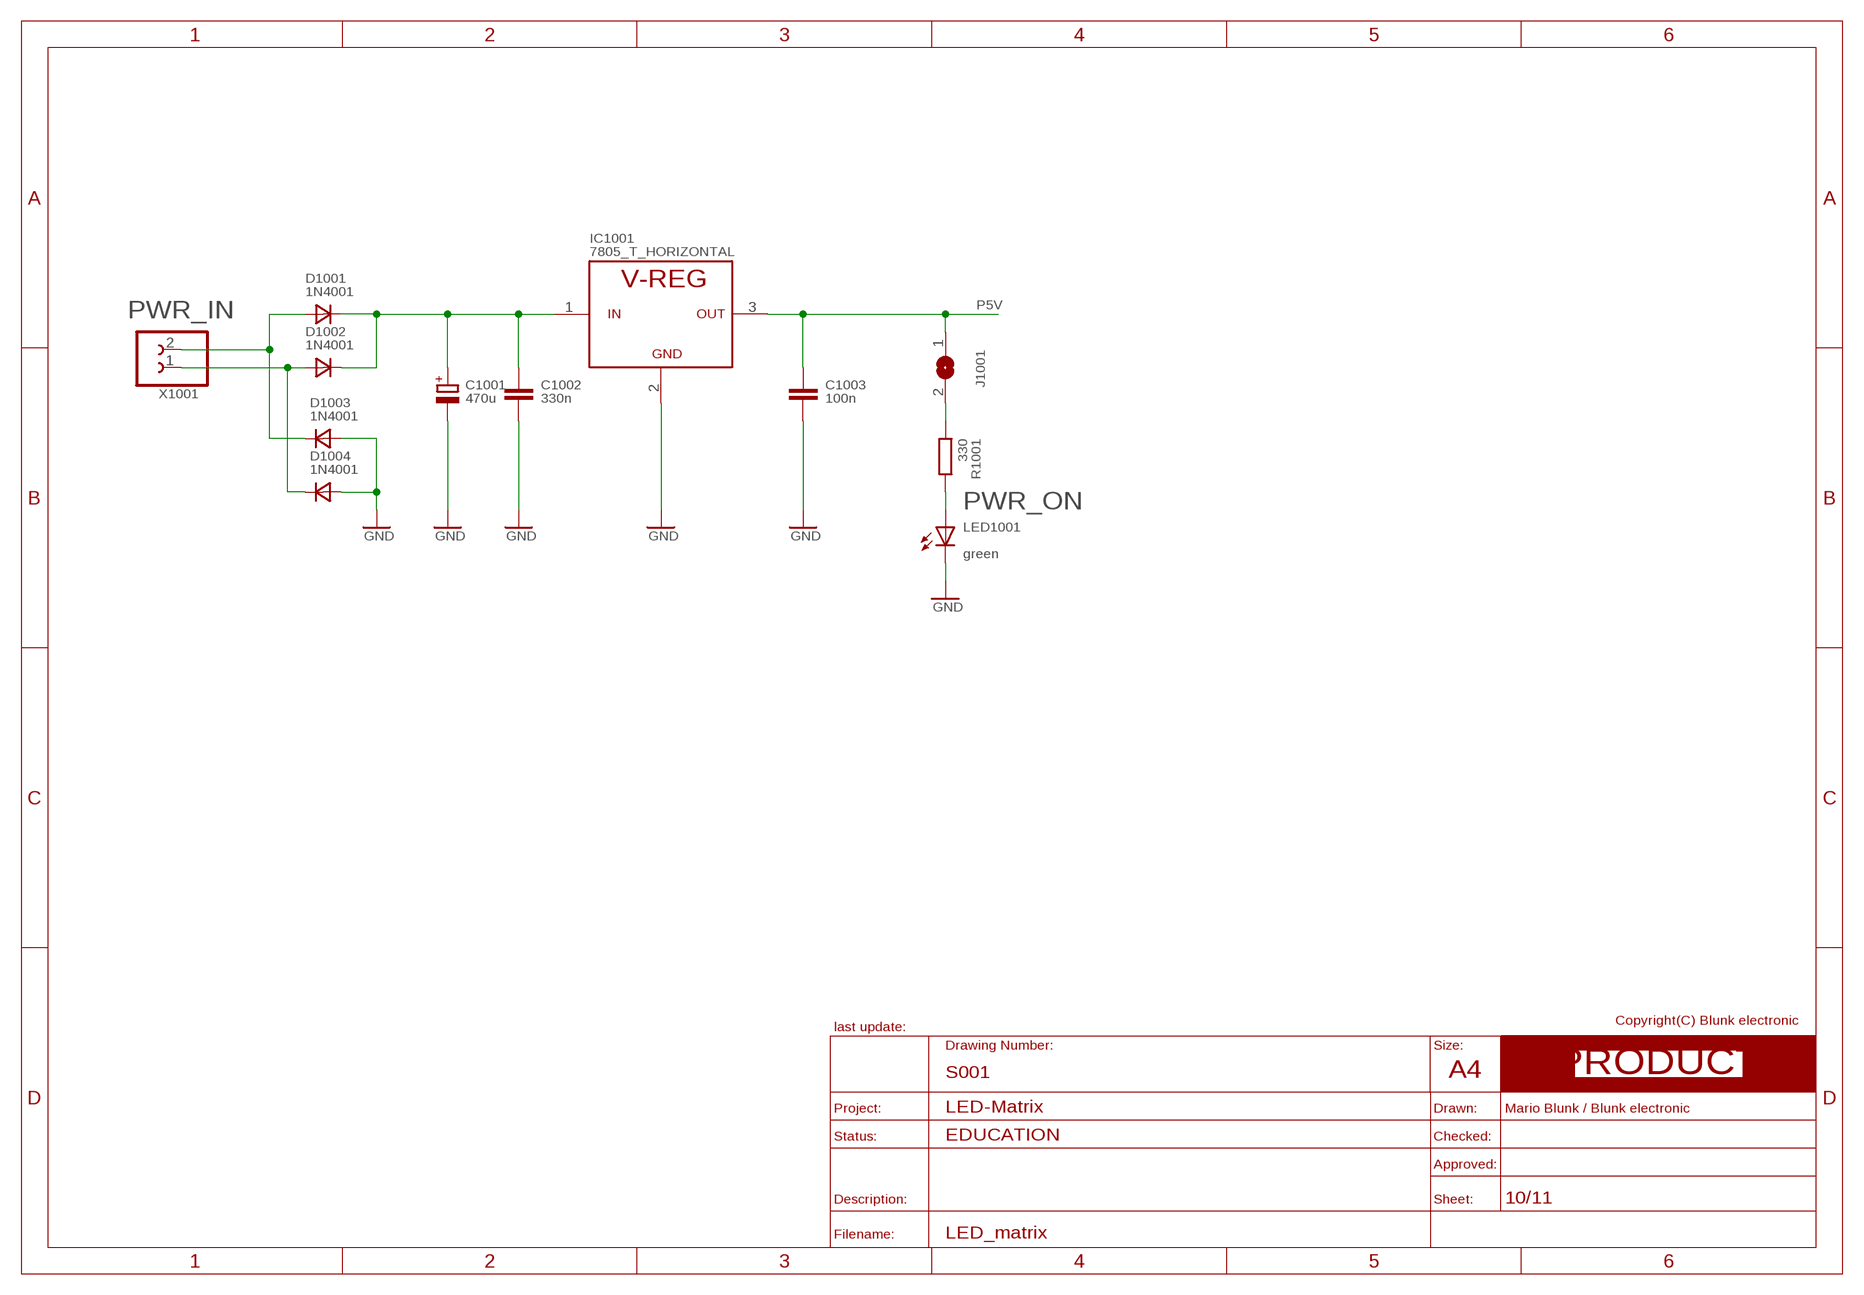
[diagram p9: schematic, sheet 10]
FRAME_PRODUCT10 (A4_LANDSCAPE_PRODUCT): BOM: NO; COMMISSIONED: 2013-08-30

### Parts
C1001  470u  C_POL_T_RAD16_GRID_7.5  [T_RADIAL_16MM_GRID_7.5MM]
C1002  330n  C_T_DSIC_7MM_PITCH_5MM  [T_DISC_7MM_PITCH_5MM]
C1003  100n  C_T_DISC_4MM_PITCH_5MM  [T_DISC_4MM_PITCH_5MM]
D1001  1N4001  SINGLE_T_DO201_GRID_18MM  [T_DO201_GRID_18MM]
D1002  1N4001  SINGLE_T_DO201_GRID_18MM  [T_DO201_GRID_18MM]
D1003  1N4001  SINGLE_T_DO201_GRID_18MM  [T_DO201_GRID_18MM]
D1004  1N4001  SINGLE_T_DO201_GRID_18MM  [T_DO201_GRID_18MM]
IC1001  7805_T_HORIZONTAL  78XX_T_HORIZONTAL  [T_TO220-3_HORIZONTAL]
J1001  SOLDER_JUMPER-N  [S_SOLDER_JUMPER_NARROW]
LED1001  green  LED_T_ROUND_3MM  [T_ROUND_3MM]
R1001  330  R_T_0207_PITCH_10MM  [T_0207_PITCH_10MM]
X1001  CLAMP_1X2-T-5MM  [T_WIRE_CLAMP_1X2_PITCH_5MM]

### Nets
GND: C1001.- C1002.2 C1003.2 D1003.A D1004.A IC1001.2(GND) LED1001.C ; also sheet 1,2,3,4,5,7,8,9,11
P5V: C1003.1 IC1001.3(OUT) J1001.1 ; also sheet 1,2,3,4,5,6,9,11
PWR_IN_AC1: D1001.A D1003.C X1001.2
PWR_IN_AC2: D1002.A D1004.C X1001.1
PWR_IN_VREG: C1001.+ C1002.1 D1001.C D1002.C IC1001.1(IN)
PWR_LED: LED1001.A R1001.2
PWR_LED_JP: J1001.2 R1001.1

## Sheet 11 of 11
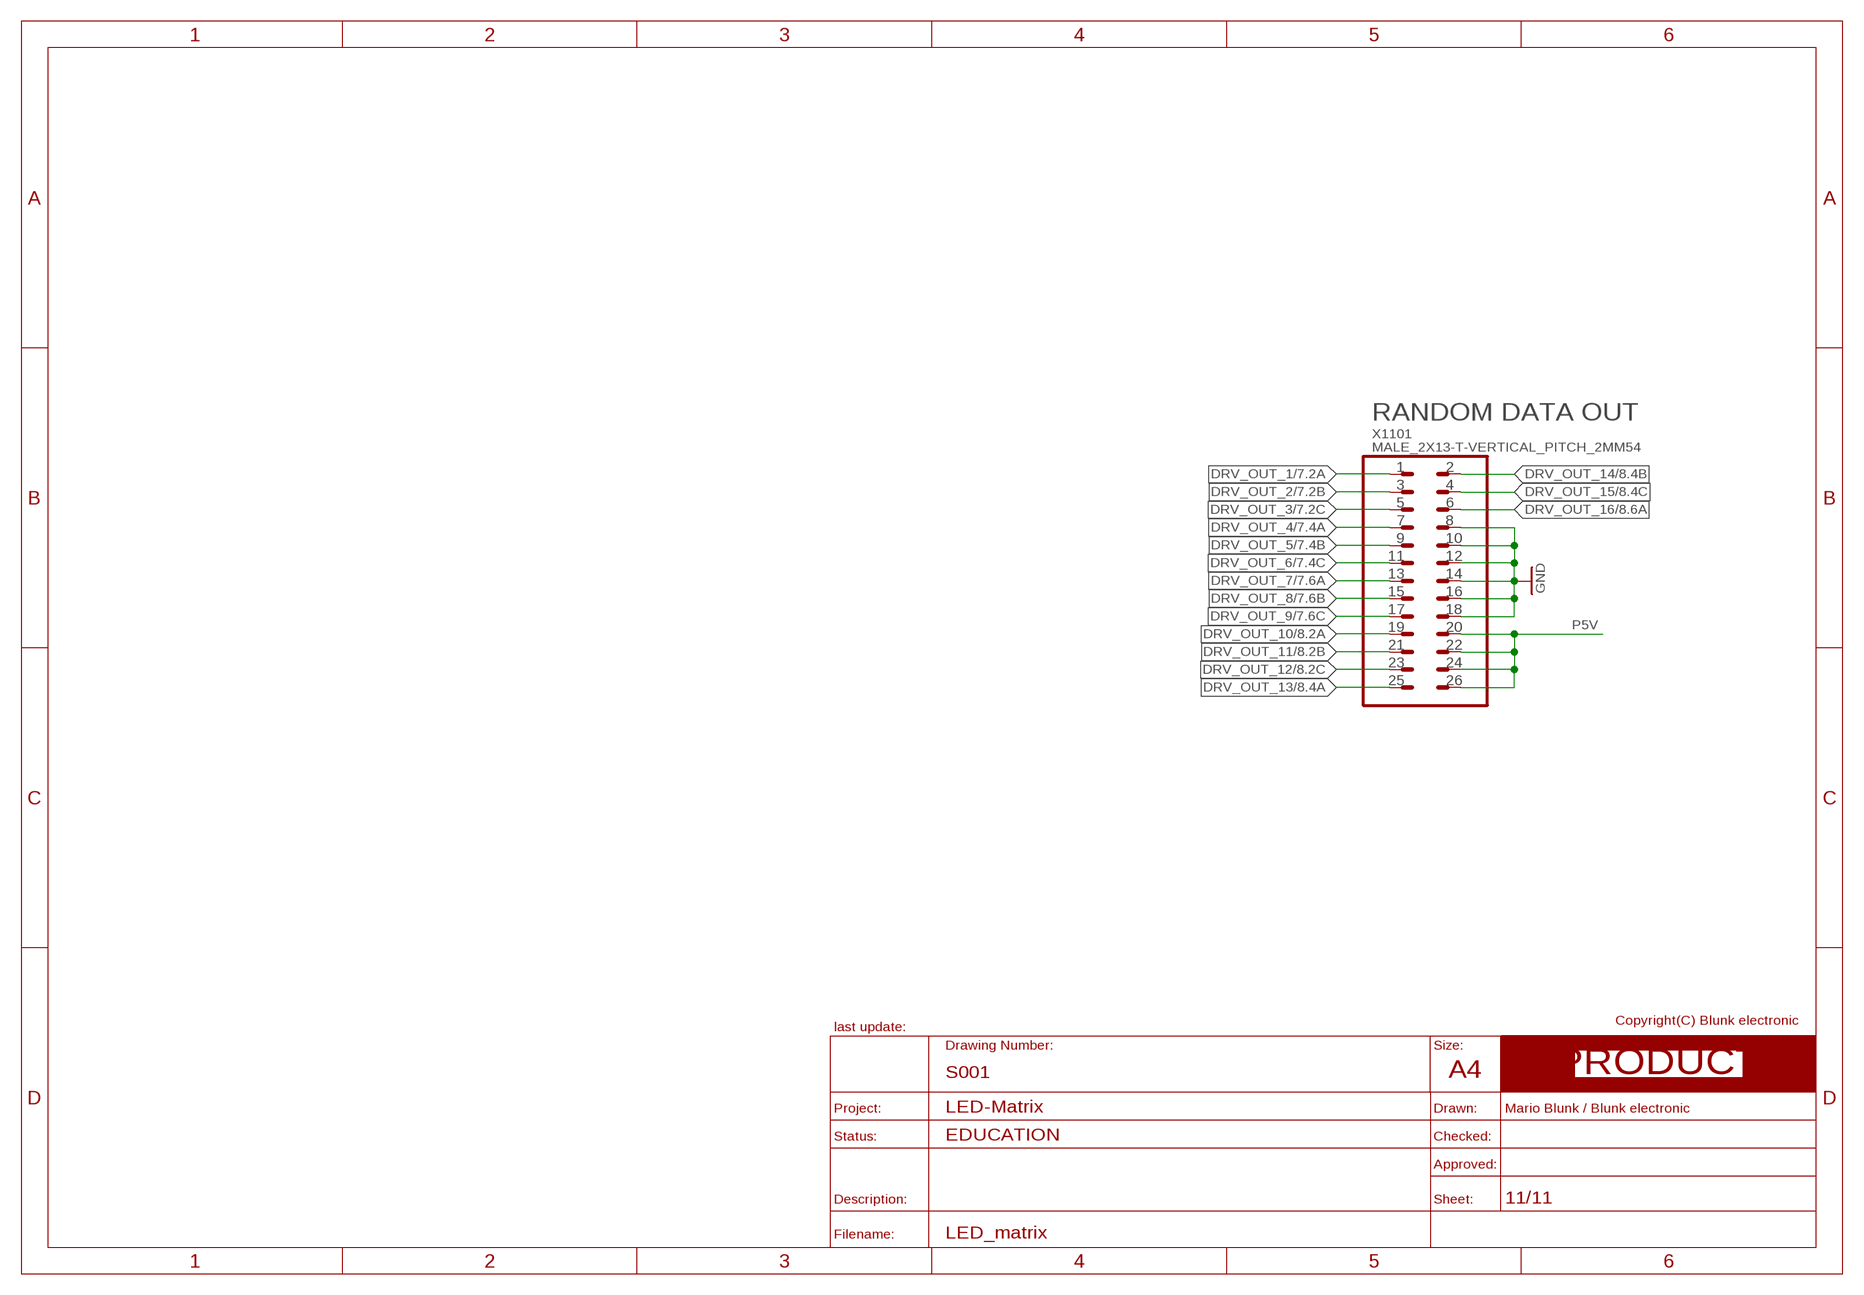
[diagram p10: schematic, sheet 11]
FRAME_PRODUCT11 (A4_LANDSCAPE_PRODUCT): BOM: NO; COMMISSIONED: 2013-08-30

### Parts
X1101  MALE_2X13-T-VERTICAL_PITCH_2MM54  [T_MALE_2X13_VERTICAL_PITCH_2MM54]

### Nets
DRV_OUT_1: X1101.1 ; also sheet 7
DRV_OUT_2: X1101.3 ; also sheet 7
DRV_OUT_3: X1101.5 ; also sheet 7
DRV_OUT_4: X1101.7 ; also sheet 7
DRV_OUT_5: X1101.9 ; also sheet 7
DRV_OUT_6: X1101.11 ; also sheet 7
DRV_OUT_7: X1101.13 ; also sheet 7
DRV_OUT_8: X1101.15 ; also sheet 7
DRV_OUT_9: X1101.17 ; also sheet 7
DRV_OUT_10: X1101.19 ; also sheet 8
DRV_OUT_11: X1101.21 ; also sheet 8
DRV_OUT_12: X1101.23 ; also sheet 8
DRV_OUT_13: X1101.25 ; also sheet 8
DRV_OUT_14: X1101.2 ; also sheet 8
DRV_OUT_15: X1101.4 ; also sheet 8
DRV_OUT_16: X1101.6 ; also sheet 8
GND: X1101.8 X1101.10 X1101.12 X1101.14 X1101.16 X1101.18 ; also sheet 1,2,3,4,5,7,8,9,10
P5V: X1101.20 X1101.22 X1101.24 X1101.26 ; also sheet 1,2,3,4,5,6,9,10

## Library data of the parts
C101 = be_rcl:C_POL: edited: Mario Blunk / Blunk electronic; BOM: YES; COMMISSIONED: 2015-01-15; PART_CODE_BEL: C_PAC_T_RADIAL_5mm_PITCH_2mm54_VAL_1u
C102-C105 C201 C202 C301 C302 C401 C402 C501 C502 = be_rcl:C: drawn: Mario Blunk / Blunk electronic; BOM: YES; COMMISSIONED: 2018-12-23; PART_CODE_BEL: C_PAC_T_DISC_7mm_PITCH_5mm_VAL_100n
C901 = be_rcl:C: drawn: Mario Blunk / Blunk electronic; BOM: YES; COMMISSIONED: 2018-12-23; PART_CODE_BEL: C_PAC_S_0805_VAL_100n
C902 = be_rcl:C: drawn: Mario Blunk / Blunk electronic; BOM: YES; COMMISSIONED: 2018-12-23; PART_CODE_BEL: C_PAC_S_0805_VAL_47n
C903 = be_rcl:C: drawn: Mario Blunk / Blunk electronic; BOM: YES; COMMISSIONED: 2018-12-23; PART_CODE_BEL: C_PAC_S_0805_VAL_10n
C1001 = be_rcl:C_POL: edited: Mario Blunk / Blunk electronic; BOM: YES; COMMISSIONED: 2015-01-23; PART_CODE_BEL: C_PAC_T_RADIAL_16mm_GRID_7.5mm_VAL_
C1002 = be_rcl:C: drawn: Mario Blunk / Blunk electronic; BOM: YES; COMMISSIONED: 2015-01-15; PART_CODE_BEL: C_PAC_T_DISC_7mm_PITCH_5mm_VAL_; UPDATED: 2018-09-16
C1003 = be_rcl:C: drawn: Mario Blunk / Blunk electronic; BOM: YES; COMMISSIONED: 2018-12-23; PART_CODE_BEL: C_PAC_T_DISC_4mm_PITCH_5mm_VAL_
D901 = be_diode:SINGLE: edited: Mario Blunk / Blunk electronic; BOM: YES; COMMISSIONED: 2018-12-06; PART_CODE_BEL: D_PAC_T_MINIPLAST_VAL_
D1001-D1004 = be_diode:SINGLE: edited: Mario Blunk / Blunk electronic; BOM: YES; COMMISSIONED: 2015-10-16; PART_CODE_BEL: D_PAC_T_DO201_GRID_18MM_VAL_
H601-H604 = be_holes:HOLE: edited: Mario Blunk; BOM: NO; COMMISSIONED: 2014-10-13
IC101 = be_logic:4093: drawn: Mario Blunk / Blunk electronic; BOM: YES; COMMISSIONED: 2014-09-06; PART_CODE_BEL: IC_PAC_T_NDIP14_VAL_4093N
IC102 = be_logic:7400: edited: Mario Blunk / Blunk electronic; BOM: YES; COMMISSIONED: 2015-10-14; PART_CODE_BEL: IC_PAC_T_NDIP14_VAL_SN74LS00N
IC103 = be_logic:74193: edited: Mario Blunk / Blunk electronic; BOM: YES; COMMISSIONED: 2018-09-16; PART_CODE_BEL: IC_PAC_NDIP16_VAL_SN74193N
IC201 IC301 IC401 IC501 = be_logic:7495: edited: Mario Blunk / Blunk electronic; BOM: YES; COMMISSIONED: 2015-05-19; PART_CODE_BEL: IC_PAC_T_NDIP14_VAL_SN7495N; UPDATED: 2018-09-16
IC202 IC302 IC402 IC502 = be_logic:74175: edited: Mario Blunk / Blunk electronic; BOM: YES; COMMISSIONED: 2018-09-16; PART_CODE_BEL: IC_PAC_NDIP16_VAL_SN74175N
IC901 = be_timer:555: edited: Mario Blunk / Blunk electronic; BOM: YES; COMMISSIONED: 2015-10-15; PART_CODE_BEL: IC_PAC_T_NDIP8_VAL_NE555V
IC1001 = be_vreg_vref:78XX: edited: Mario Blunk / Blunk electronic; BOM: YES; COMMISSIONED: 2018-12-09; PART_CODE_BEL: IC_PAC_T_TO220-3_HORIZONTAL_VAL_
J1001 = be_con_jump:SOLDER_JUMPER: solder jumper device drawn: Mario Blunk / Blunk electronic; BOM: NO; COMMISSIONED: 2013-08-30; PART_CODE_BEL: J_PAC_S_SOLDER_JUMPER_NARROW
LED701 = be_opt:LED: edite: Mario Blunk / Blunk electronic; BOM: YES; COMMISSIONED: 2014-10-14; FUNCTION: RND1; PART_CODE_BEL: LED_PAC_T_ROUND_3mm_VAL_
LED702 = be_opt:LED: edite: Mario Blunk / Blunk electronic; BOM: YES; COMMISSIONED: 2014-10-14; PART_CODE_BEL: LED_PAC_T_ROUND_3mm_VAL_; PURPOSE: RND2
LED703 = be_opt:LED: edite: Mario Blunk / Blunk electronic; BOM: YES; COMMISSIONED: 2014-10-14; PART_CODE_BEL: LED_PAC_T_ROUND_3mm_VAL_; PURPOSE: RND3
LED704 = be_opt:LED: edite: Mario Blunk / Blunk electronic; BOM: YES; COMMISSIONED: 2014-10-14; PART_CODE_BEL: LED_PAC_T_ROUND_3mm_VAL_; PURPOSE: RND4
LED705 = be_opt:LED: edite: Mario Blunk / Blunk electronic; BOM: YES; COMMISSIONED: 2014-10-14; PART_CODE_BEL: LED_PAC_T_ROUND_3mm_VAL_; PURPOSE: RND5
LED706 = be_opt:LED: edite: Mario Blunk / Blunk electronic; BOM: YES; COMMISSIONED: 2014-10-14; PART_CODE_BEL: LED_PAC_T_ROUND_3mm_VAL_; PURPOSE: RND6
LED707 = be_opt:LED: edite: Mario Blunk / Blunk electronic; BOM: YES; COMMISSIONED: 2014-10-14; PART_CODE_BEL: LED_PAC_T_ROUND_3mm_VAL_; PURPOSE: RND7
LED708 = be_opt:LED: edite: Mario Blunk / Blunk electronic; BOM: YES; COMMISSIONED: 2014-10-14; PART_CODE_BEL: LED_PAC_T_ROUND_3mm_VAL_; PURPOSE: RND8
LED709 = be_opt:LED: edite: Mario Blunk / Blunk electronic; BOM: YES; COMMISSIONED: 2014-10-14; PART_CODE_BEL: LED_PAC_T_ROUND_3mm_VAL_; PURPOSE: RND9
LED801 = be_opt:LED: edite: Mario Blunk / Blunk electronic; BOM: YES; COMMISSIONED: 2014-10-14; PART_CODE_BEL: LED_PAC_T_ROUND_3mm_VAL_; PURPOSE: RND10
LED802 = be_opt:LED: edite: Mario Blunk / Blunk electronic; BOM: YES; COMMISSIONED: 2014-10-14; PART_CODE_BEL: LED_PAC_T_ROUND_3mm_VAL_; PURPOSE: RND11
LED803 = be_opt:LED: edite: Mario Blunk / Blunk electronic; BOM: YES; COMMISSIONED: 2014-10-14; PART_CODE_BEL: LED_PAC_T_ROUND_3mm_VAL_; PURPOSE: RND12
LED804 = be_opt:LED: edite: Mario Blunk / Blunk electronic; BOM: YES; COMMISSIONED: 2014-10-14; PART_CODE_BEL: LED_PAC_T_ROUND_3mm_VAL_; PURPOSE: RND13
LED805 = be_opt:LED: edite: Mario Blunk / Blunk electronic; BOM: YES; COMMISSIONED: 2014-10-14; PART_CODE_BEL: LED_PAC_T_ROUND_3mm_VAL_; PURPOSE: RND14
LED806 = be_opt:LED: edite: Mario Blunk / Blunk electronic; BOM: YES; COMMISSIONED: 2014-10-14; PART_CODE_BEL: LED_PAC_T_ROUND_3mm_VAL_; PURPOSE: RND15
LED807 = be_opt:LED: edite: Mario Blunk / Blunk electronic; BOM: YES; COMMISSIONED: 2014-10-14; PART_CODE_BEL: LED_PAC_T_ROUND_3mm_VAL_; PURPOSE: RND16
LED1001 = be_opt:LED: edite: Mario Blunk / Blunk electronic; BOM: YES; COMMISSIONED: 2014-10-14; FUNCTION: PWR_ON; PART_CODE_BEL: LED_PAC_T_ROUND_3mm_VAL_green
N201 N301 N401 N501 N701-N709 N801-N807 = be_con_jump:NET_CHANGER: drawn: Mario Blunk / Blunk electronic; BOM: NO; COMMISSIONED: 2014-04-09; PART_CODE_BEL: N_PAC_S_NET_CHANGER_0.3MM
R101 R102 = be_rcl:R: edited: Mario Blunk / Blunk electronic; BOM: YES; COMMISSIONED: 2014-10-13; PART_CODE_BEL: R_PAC_T_0207_PITCH_10mm_VAL_10k
R103 = be_rcl:RA: edited: Mario Blunk / Blunk electronic; BOM: YES; COMMISSIONED: 2018-11-11; FUNCTION: REFRESH RATE; PART_CODE_BEL: R_PAC_T_TRIM_PIHER_PT10_HORIZONTAL_VAL_50k
R701-R703 R707-R709 R713-R715 R801-R803 R807-R809 R813 = be_rcl:R: edited: Mario Blunk / Blunk electronic; BOM: YES; COMMISSIONED: 2014-10-13; PART_CODE_BEL: R_PAC_T_0207_PITCH_10mm_VAL_
R704-R706 R710-R712 R716-R718 R804-R806 R810-R812 R814 R1001 = be_rcl:R: edited: Mario Blunk / Blunk electronic; BOM: YES; COMMISSIONED: 2014-10-13; PART_CODE_BEL: R_PAC_T_0207_PITCH_10mm_VAL_330
R901 R905 = be_rcl:R: edited: Mario Blunk / Blunk electronic; BOM: YES; COMMISSIONED: 2014-10-13; PART_CODE_BEL: R_PAC_S_0805_VAL_10k
R902 = be_rcl:R: edited: Mario Blunk / Blunk electronic; BOM: YES; COMMISSIONED: 2014-10-13; PART_CODE_BEL: R_PAC_S_0805_VAL_470k
R903 = be_rcl:R: edited: Mario Blunk / Blunk electronic; BOM: YES; COMMISSIONED: 2014-10-13; PART_CODE_BEL: R_PAC_S_0805_VAL_1k
R904 = be_rcl:RA: edited: Mario Blunk / Blunk electronic; BOM: YES; COMMISSIONED: 2018-11-11; FUNCTION: BRIGHTNESS; PART_CODE_BEL: R_PAC_T_TRIM_PIHER_PT10_HORIZONTAL_VAL_
R906 = be_rcl:R: edited: Mario Blunk / Blunk electronic; BOM: YES; COMMISSIONED: 2014-10-13; PART_CODE_BEL: R_PAC_S_0805_VAL_330
RN601 = be_rcl:RN_4: edited: Mario Blunk / Blunk electronic; BOM: YES; COMMISSIONED: 2014-10-14; PART_CODE_BEL: RN_PAC_T_SIL8_VAL_10k; UPDATED: 2015-10-14
RPH901 = be_rcl:RPH: edited: Mario Blunk / Blunk electronic; BOM: YES; COMMISSIONED: 2018-12-15; FUNCTION: LIGHT SENSOR; PART_CODE_BEL: RPH_PAC_T_TO39-2_VAL_
T701-T709 T801-T807 = be_transistor:NPN: edited: Mario Blunk; BOM: YES; COMMISSIONED: 2014-10-14; PART_CODE_BEL: T_PAC_T_TO92-CBE_VAL
T901 = be_transistor:PNP: edited: Mario Blunk; BOM: YES; COMMISSIONED: 2014-10-14; PART_CODE_BEL: T_PAC_T_TO126_VERTICAL_VAL_
TP101-TP105 TP201 TP301 TP401 TP501 TP601-TP606 = be_con_jump:TEST_POINT: test point device drawn: Mario Blunk / Blunk electronic; BOM: NO; COMMISSIONED: 2013-08-30; PART_CODE_BEL: TP_PAC_T_TEST_POINT_SMALL
X1001 = be_con_jump:CLAMP_1X2: drawn: Mario Blunk / Blunk electronic; BOM: YES; COMMISSIONED: 2014-02-26; FUNCTION: PWR_IN; PART_CODE_BEL: X_PAC_T_CLAMP_1X2_PITCH_5mm
X1101 = be_con_jump:MALE_2X13: edited: Mario Blunk; BOM: YES; COMMISSIONED: 2015-02-03; FUNCTION: RANDOM DATA OUT; PART_CODE_BEL: X_PAC_T_MALE_2X13_VERTICAL_PITCH_2mm54

## Net classes
1 pwr: width 0.3 mm